# Altium project HU_revB.PrjPcb (part 3 of 4)

## Sheet 3V3_REG.SchDoc
size B; SheetNumber: 12; SheetTotal: 17
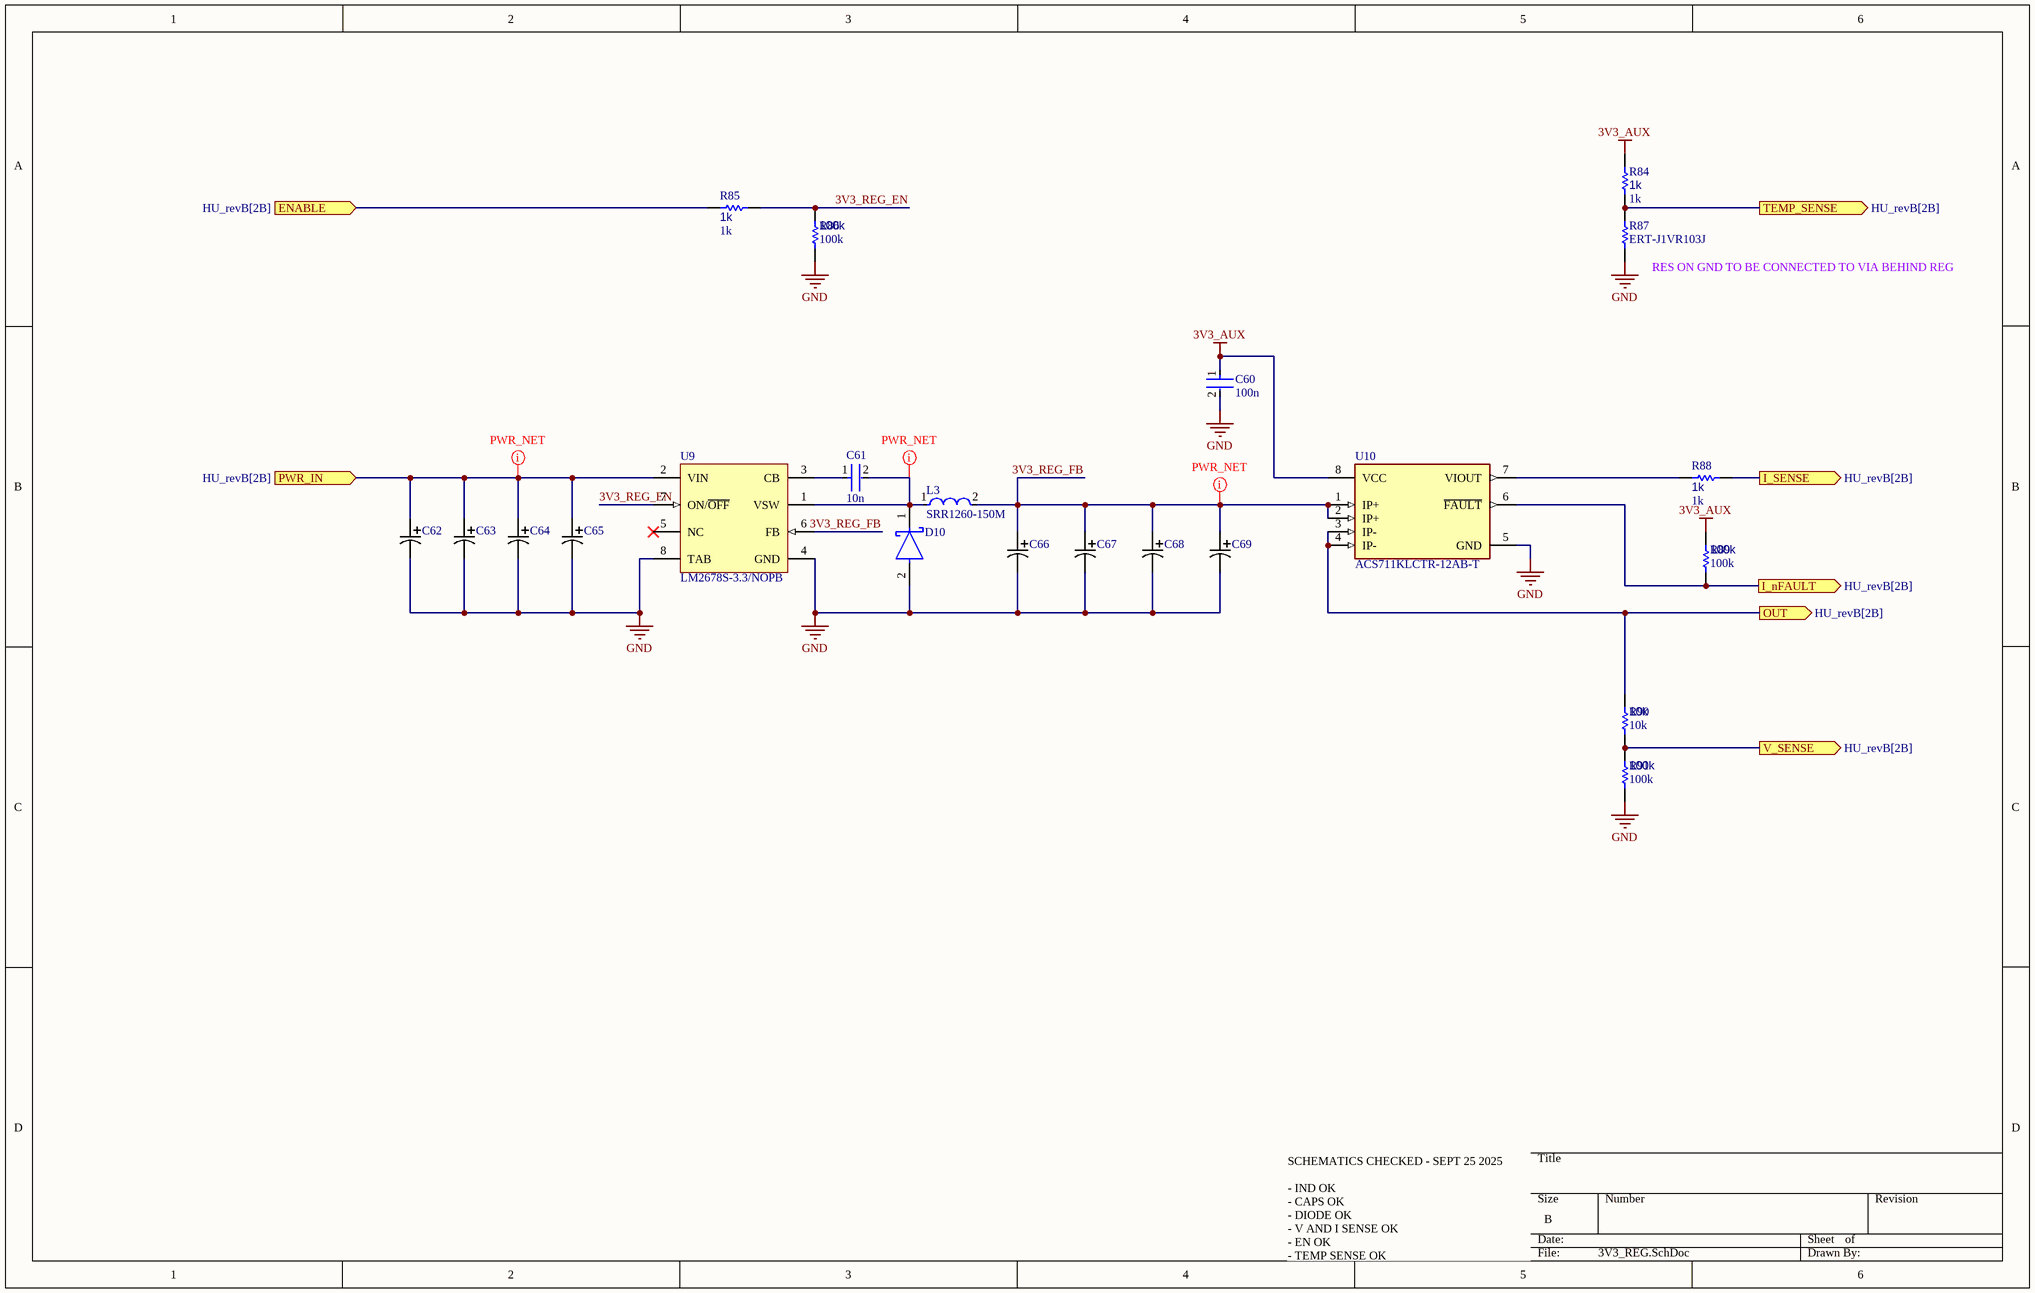
[diagram p17: 3V3_REG.SchDoc]

### Parts
C60  100n  [FP-0402-L_1_0_0_05-W_0_5-IPC_A]
C61  10n  [FP-0402-L_1_0_0_05-W_0_5-IPC_A]
C62  T495D475K050ATE300  [T495D475K050ATE300-Footprint-1]  (value not drawn)
C63  T495D475K050ATE300  [T495D475K050ATE300-Footprint-1]  (value not drawn)
C64  T495D475K050ATE300  [T495D475K050ATE300-Footprint-1]  (value not drawn)
C65  T495D475K050ATE300  [T495D475K050ATE300-Footprint-1]  (value not drawn)
C66  T495D337K010ATE150  [T495D337K010ATE150-Footprint-1]  (value not drawn)
C67  T495D337K010ATE150  [T495D337K010ATE150-Footprint-1]  (value not drawn)
C68  T495D337K010ATE150  [T495D337K010ATE150-Footprint-1]  (value not drawn)
C69  T495D337K010ATE150  [T495D337K010ATE150-Footprint-1]  (value not drawn)
D10  B540C-13-F  [FP-SMC-MFG]  (value not drawn)
L3  SRR1260-150M  [FP-SRR1260-MFG]
R84  1k  [R0603B]
R85  1k  [R0603B]
R86  100k  [R0603B]
R87  ERT-J1VR103J  [RESC1608X90X30ML15T20]
R88  1k  [R0603B]
R89  100k  [R0603B]
R90  10k  [R0603B]
R91  100k  [R0603B]
U9  LM2678S-3.3/NOPB  [KTW0007B_N]
U10  ACS711KLCTR-12AB-T  [FP-LC-8-IPC_C]

### Ports
ENABLE (in, see HU_revB[2B]), I_nFAULT (out, see HU_revB[2B]), I_SENSE (out, see HU_revB[2B]), OUT (out, see HU_revB[2B]), PWR_IN (in, see HU_revB[2B]), TEMP_SENSE (out, see HU_revB[2B]), V_SENSE (out, see HU_revB[2B])

### Nets
3V3_AUX: C60.1 R84.1 R89.2 R90.2 U10.3(IP-) U10.4(IP-) U10.8(VCC) ; port OUT
GND: C60.2 C62.2 C63.2 C64.2 C65.2 C66.2 C67.2 C68.2 C69.2 D10.2(A) R86.1 R87.1 R91.1 U9.4(GND) U9.8(TAB) U10.5(GND)
3V3_EN: R85.2 ; port ENABLE
3V3_REG_EN: R85.1 R86.2 U9.7(ON/~{OFF})
3V3_REG_FB: C66.1 C67.1 C68.1 C69.1 L3.2 U9.6(FB) U10.1(IP+) U10.2(IP+)
NetC61_1: C61.1 U9.3(CB)
NetC61_2: C61.2 D10.1(C) L3.1 U9.1(VSW)
NetC62_1: C62.1 C63.1 C64.1 C65.1 U9.2(VIN) ; port PWR_IN
NetR84_2: R84.2 R87.2 ; port TEMP_SENSE
NetR88_1: R88.1 ; port I_SENSE
NetR88_2: R88.2 U10.7(VIOUT)
NetR89_1: R89.1 U10.6(~{FAULT}) ; port I_nFAULT
NetR90_1: R90.1 R91.2 ; port V_SENSE

Not connected (* = marked no-connect by the designer): U9 5(NC)*

### Layout directives
net class PWR: 3V3_REG_FB, NetC61_2, NetC62_1

### Notes on the sheet
- (near R87) RES ON GND TO BE CONNECTED TO VIA BEHIND REG
- SCHEMATICS CHECKED - SEPT 25 2025
  - IND OK
  - CAPS OK
  - DIODE OK
  - V AND I SENSE OK
  - EN OK
  - TEMP SENSE OK

### Library data of the parts
C60 C61 = CMP-001-00058-1: as C19-C28 on sheet NVME; Min Operating Temperature: -55°C; Mounting Technology: Surface Mount; Pins: 2; Case/Package: 0402; RoHS Compliant: Yes; Max Operating Temperature: 85°C
C62-C65 = CMP-001-00066-1: Cap Tant Solid 4.7uF 50V D CASE 10% (7.3 X 4.3 X 2.8mm) SMD 7343-31 0.3 Ohm 125 C T/R; Value: 4.7µF; Min Operating Temperature: -55°C; Voltage Rating: 50V; Tolerance: 10%; Mounting Technology: Surface Mount; Max Operating Temperature: 125°C; Case/Package: 7343-31; Pins: 2
C66-C69 = CMP-001-00067-1: 330uF Solid MnO2 Tantalum Capacitor, 10 V dc +/-10%, T495 Series; Tolerance: 10%; Voltage Rating: 10V; Value: 330µF; Case/Package: 2917; Min Operating Temperature: -55°C; Mounting Technology: Surface Mount; Max Operating Temperature: 125°C
D10 = CMP-2000-05097-3: DIODE SCHOTTKY 40V 5A SMC; Manufacturer: Diodes Inc.; Automotive Grade: NA; Peak Reverse Current: 0.5mA; Value: 300pF; Max Junction Temp: +150°C; Max Surge Forward Current: 100A; Standoff Height: 0.1mm; Digikey Description: DIODE SCHOTTKY 40V 5A SMC; Temperature Range Low: -55°C; Manufacturer Part Number: B540C-13-F; Octopart: https://octopart.com/b540c-13-f-diodes+inc.-325873; Lead Free: Yes; Reverse Voltage: 40V; RoHS: TRUE; Category: Diode; Mouser Description: Diode: Schottky rectifying; SMD; 40V; 5A; SMC; Package: reel, tape; ComponentLink2Description: Datasheet; Temperature Range High: +150°C; Automotive: No; Footprint Url: https://www.diodes.com/assets/Package-Files/SMC.pdf; Device Class L3: Schottky Diodes; Height: 2.5mm; Forward Current: 5A; Temperature: -55°C to +150°C; Package: SMC; ComponentLink2URL: https://www.diodes.com/assets/Datasheets/ds13012.pdf; Device Class L2: Diodes; Max Repetitive Reverse Voltage: 40V; Device Class L1: Discrete Semiconductors; Capacitance: 300pF
L3 = CMP-2000-07146-2: FIXED IND 15UH 5A 27 MOHM SMD; Q Factor: 25; Sample Rate (Hz): 100kHz; Resistance: 27MR; Material: Steel; Inductance Tolerance: 20%; Frequency: 17.6MHz; Saturation Current: 4.6A; Core Material: Ferrite; Shielding: Shielded; Series: SRR1260; Termination: SMD/SMT; Packaging: Tape and Reel; RoHS Compliant: Yes; Height - Seated (Max): 0.256inch; Depth: 12.8mm; Case/Package: 1260; Inductance: 15uH; Height: 6mm; Number of Pins: 2; Mount: Surface Mount; Min Operating Temperature: -40°C; Test Frequency: 100kHz; Length: 12.5mm; Self Resonant Frequency: 17.6MHz; Current Rating: 5A; Tolerance: 20%; RMS Current (Irms): 5A; REACH SVHC: No SVHC; Resistor Type: Wirewound; DC Resistance (DCR): 27mR; Width: 12.5mm; Package Quantity: 600; DC Current: 5A; Max DC Current: 5A; Max Operating Temperature: 125°C; Military Standard: Not
R84-R86 R88-R91 = CMP-009-00002-14: Resistor
  R84 R85 R88: Value: 1k
  R86 R89 R91: Value: 100k
  R90: Value: 10k
R87 = CMP-2000-00869-1: Manufacturer: Panasonic; Part Number: ERT-J1VR103J
U9 = CMP-0069-00195-3: SIMPLE SWITCHER® High Efficiency 5A Step-Down Voltage Regulator, 7-pin TO-263, Pb-Free; Manufacturer: Texas Instruments; PackageTopMarking: NSUZXYTTE#*LM2678*S-3.3; PowerWise: N; PackageReference: KTW0007B; Code_JEDEC: MO-169-AC; CompType: Switcher; RoHS: Y; PackageDescription: TO-263, Molded, .400 x .390 x .180in Body, 7 Lead, .050in Pitch, Surface Mount; ComponentLink1Description: Datasheet URL; PinCount: 7; ComponentLink1URL: http://www.ti.com/general/docs/lit/getliterature.tsp?genericPartNumber=LM2678&fileType=pdf
U10 = CMP-1557-00012-2: SENSOR CURRENT HALL 12.5A AC/DC; Number of Channels: 1; Min Supply Voltage: 3V; Sensitivity: 110mV/A; Response Time: 4.6us; Operating Supply Voltage: 3.3V; Max Supply Voltage: 5.5V; Max Supply Current: 5.5mA; Bandwidth: 100kHz; Linearity: 1%; Quiescent Current: 4mA; Accuracy: 5%; Polarity: Bidirectional; Case/Package: SOIC; Packaging: Tape and Reel; Number of Pins: 8; Width: 3.9mm; Frequency: 100kHz; -3db Bandwidth: 100kHz; REACH SVHC: No SVHC; Series: -; Height: 1.5mm; Package Quantity: 1; Min Operating Temperature: -40°C; Max Operating Temperature: 125°C; Current Sensing: 12.5A; RoHS Compliant: Yes; Length: 4.9mm

## Sheet GMSL_DESERIALIZER.SchDoc
size C; SheetNumber: 13; SheetTotal: 17
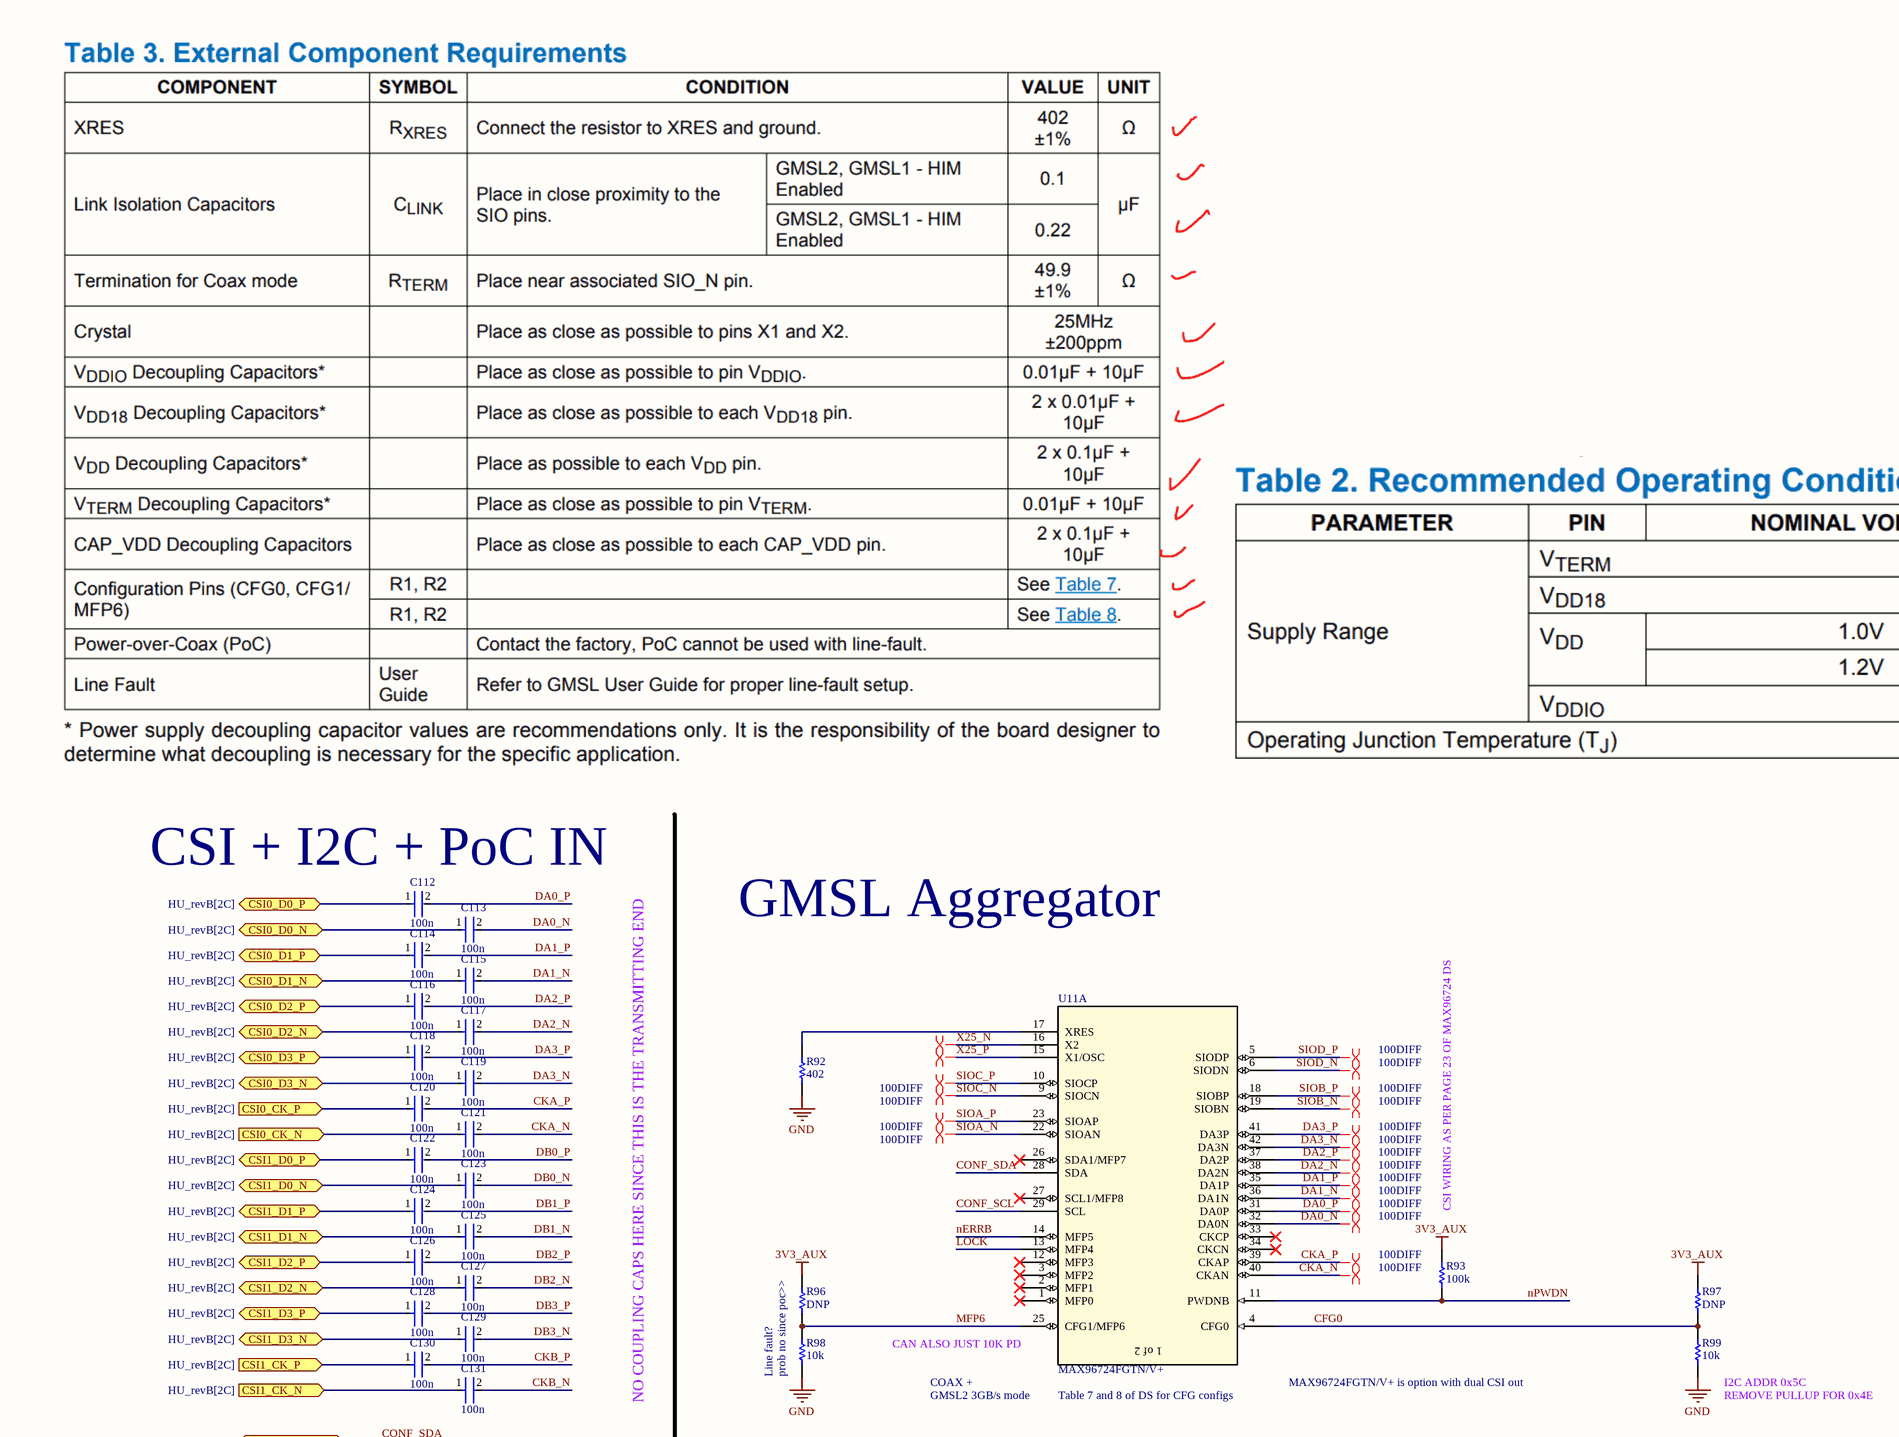
[diagram p18: GMSL_DESERIALIZER.SchDoc, top left]
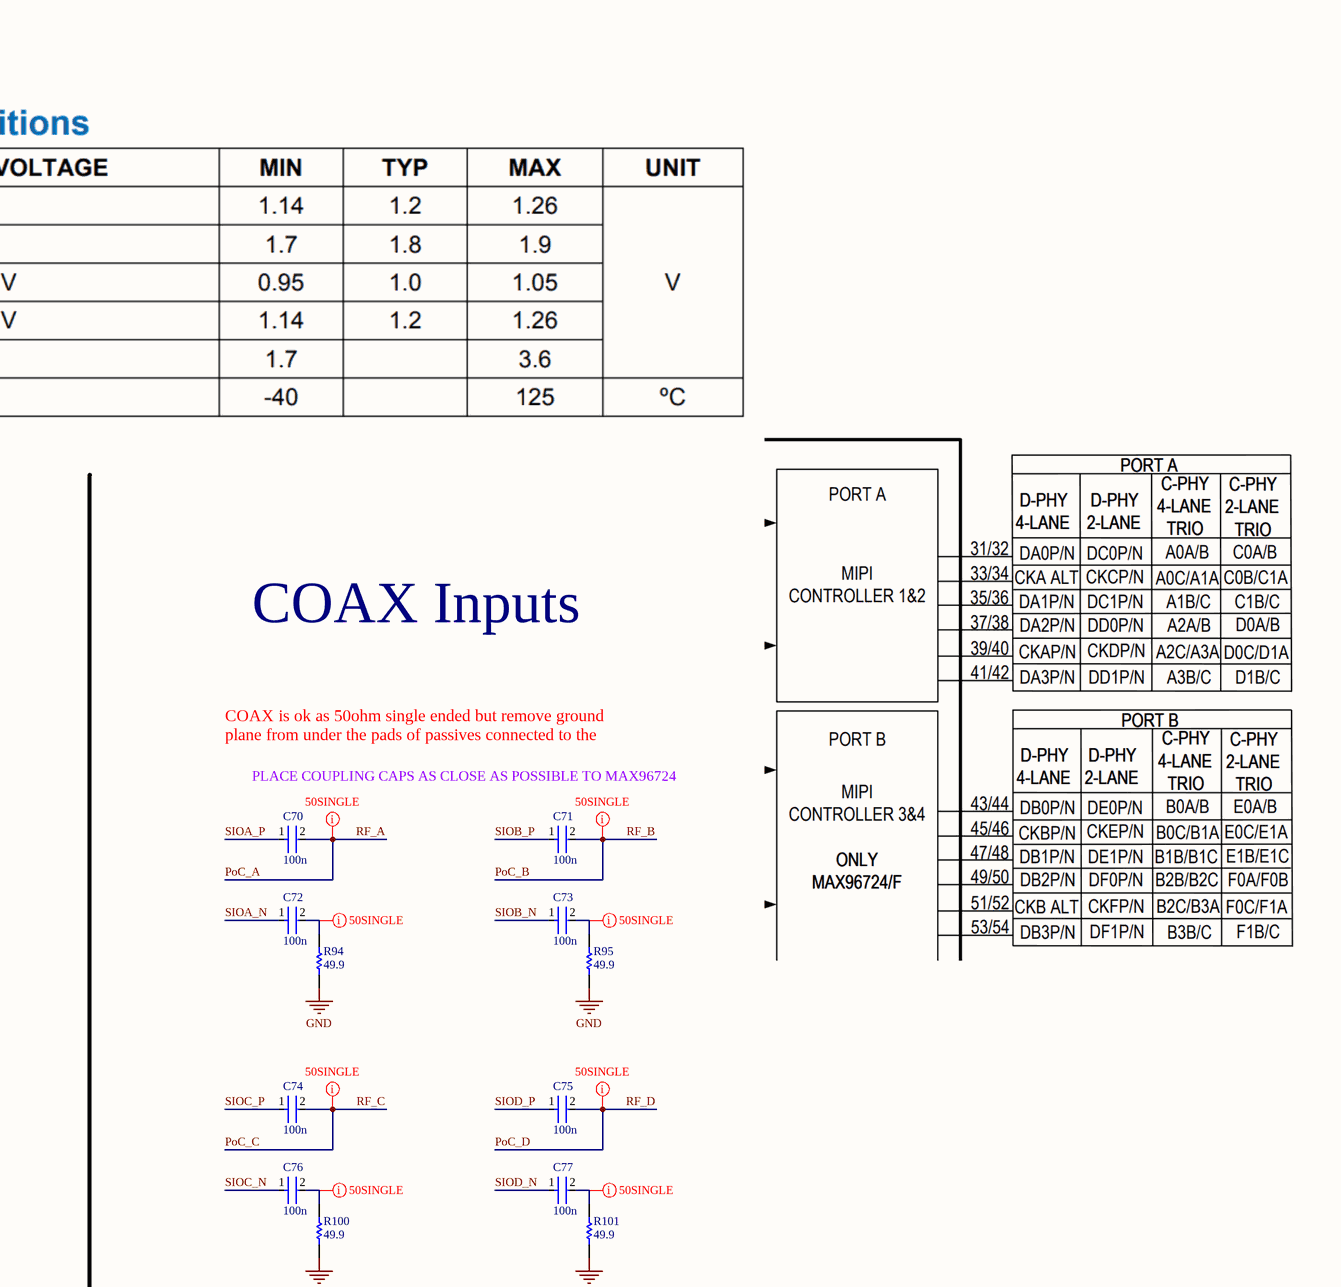
[diagram p19: GMSL_DESERIALIZER.SchDoc, top right]
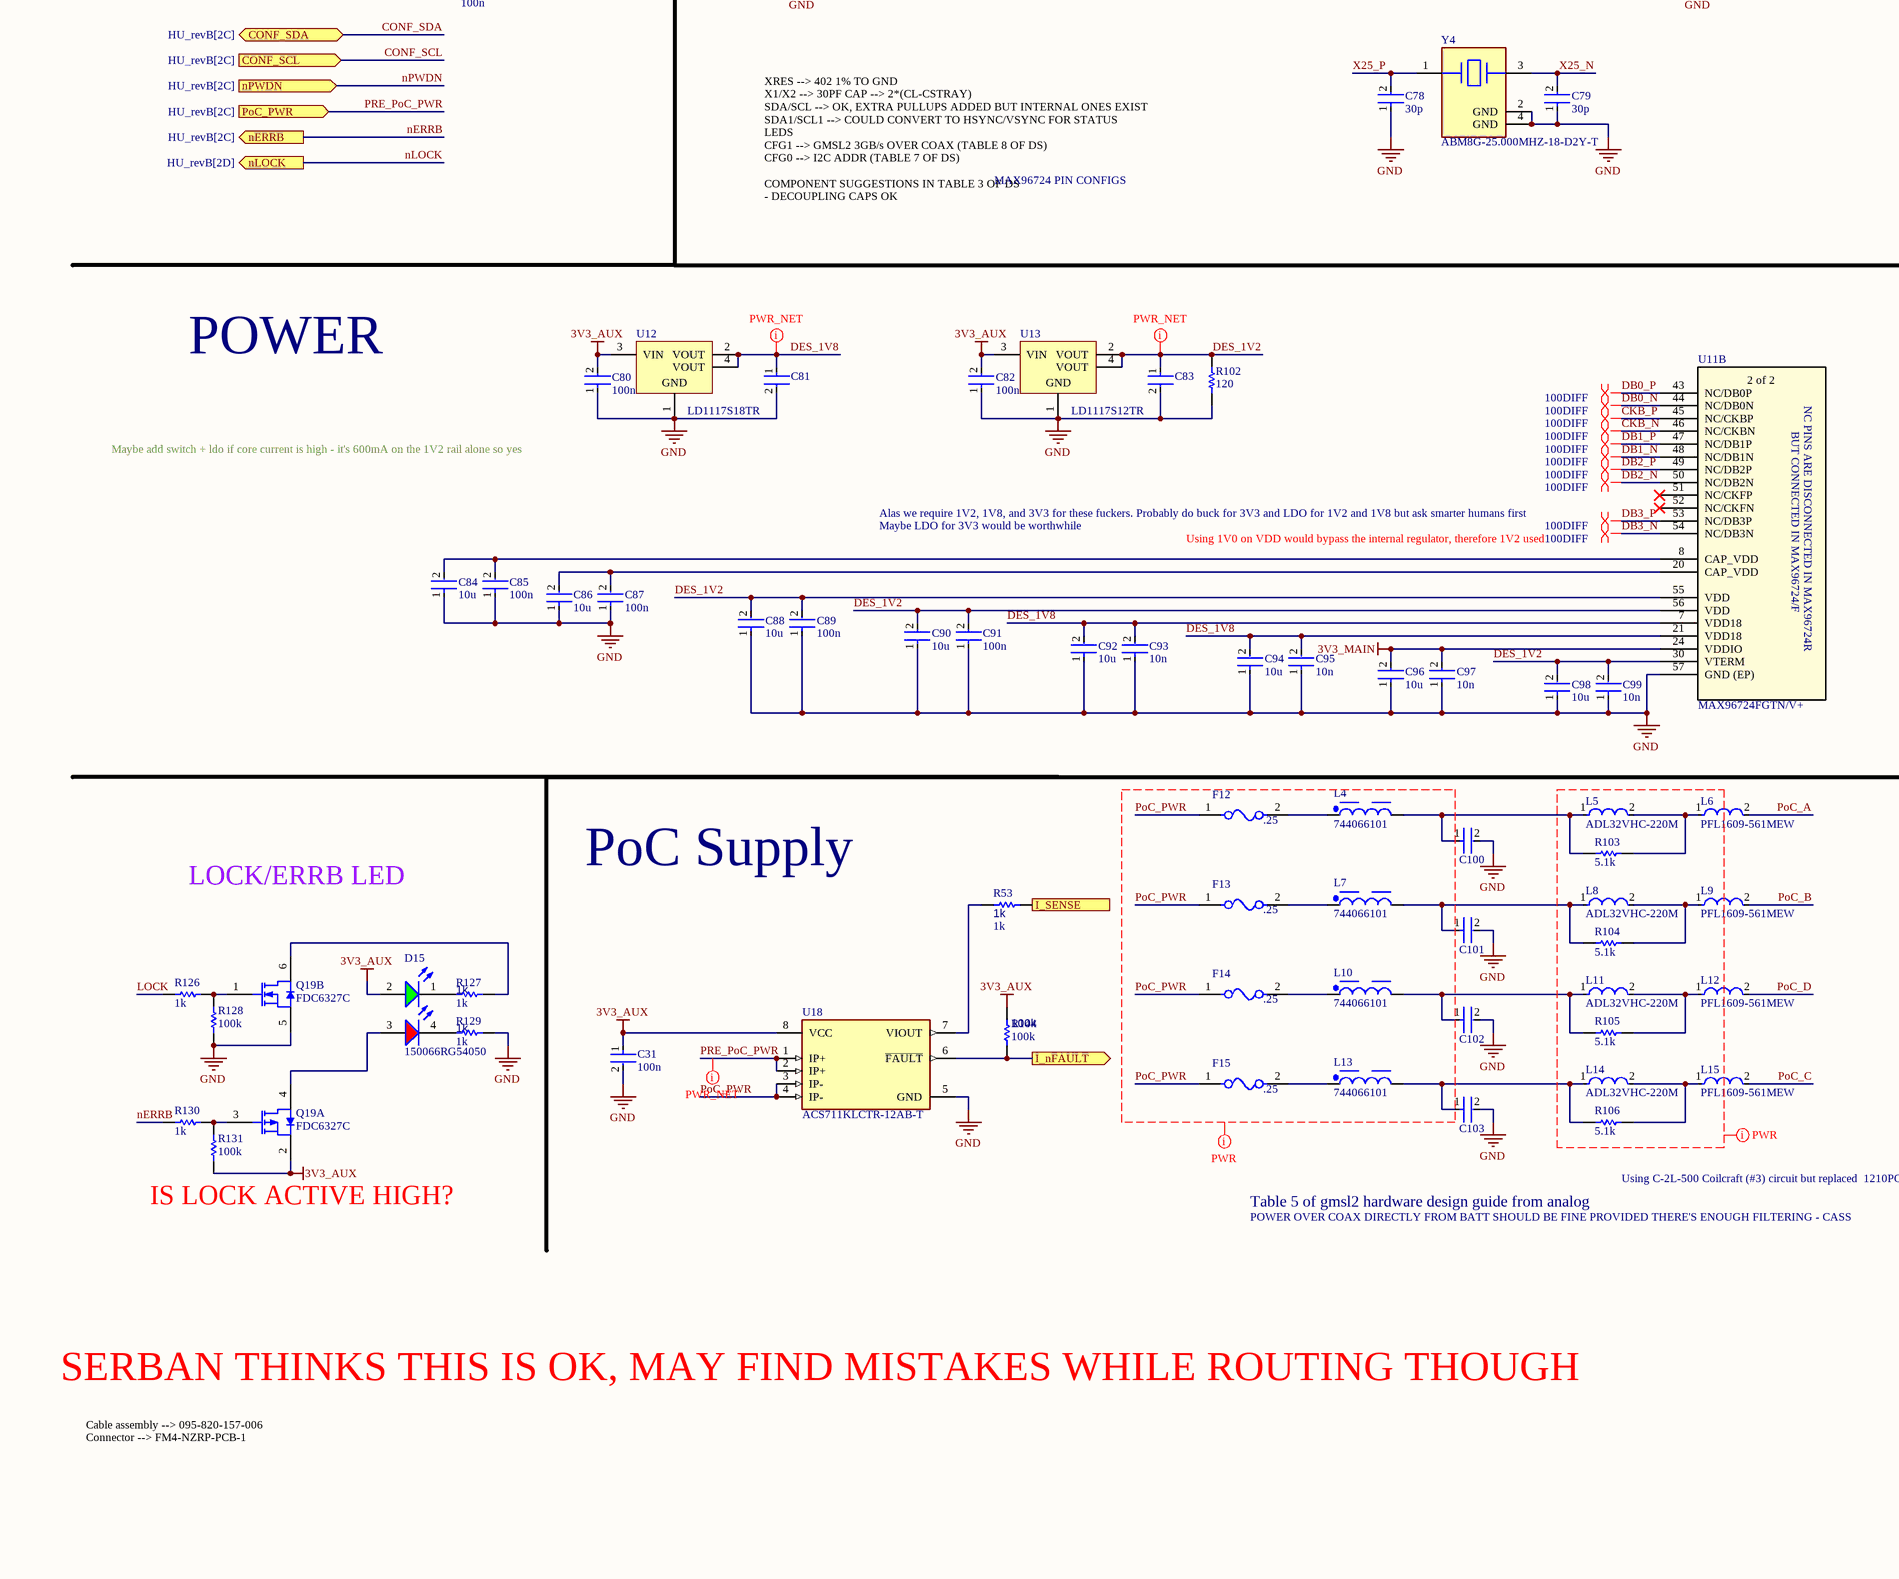
[diagram p20: GMSL_DESERIALIZER.SchDoc, bottom left]
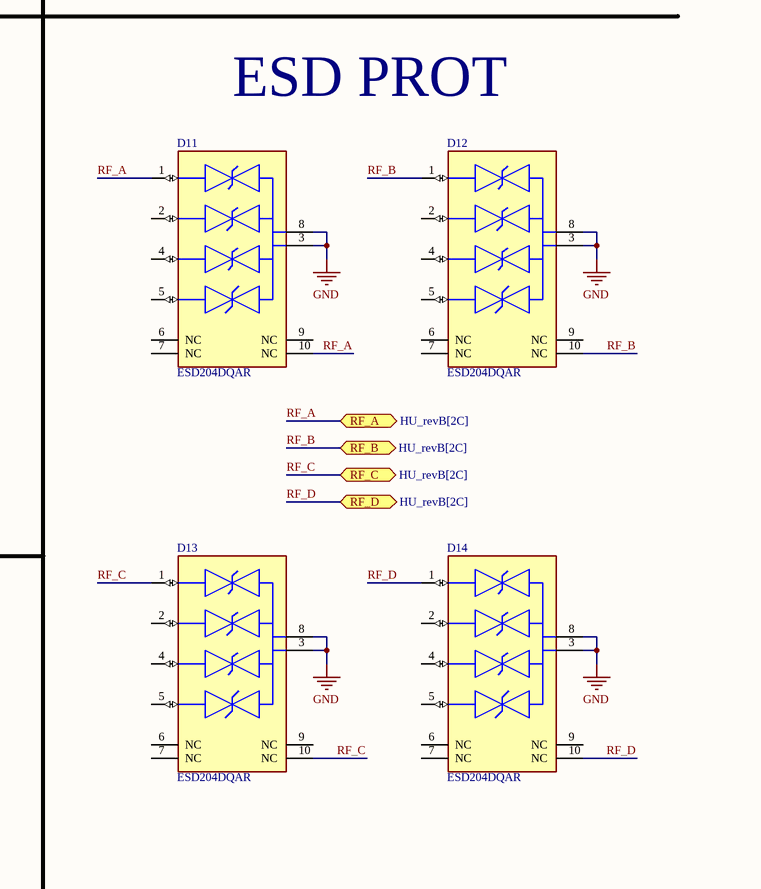
[diagram p21: GMSL_DESERIALIZER.SchDoc, bottom right]

### Parts
(Parts that share a designator on the sheet are numbered #1, #2 ... from top to bottom, then left to right.)
C31#2  100n  [FP-0402-L_1_0_0_05-W_0_5-IPC_A]
C70  100n  [FP-0402-L_1_0_0_05-W_0_5-IPC_A]
C71  100n  [FP-0402-L_1_0_0_05-W_0_5-IPC_A]
C72  100n  [FP-0402-L_1_0_0_05-W_0_5-IPC_A]
C73  100n  [FP-0402-L_1_0_0_05-W_0_5-IPC_A]
C74  100n  [FP-0402-L_1_0_0_05-W_0_5-IPC_A]
C75  100n  [FP-0402-L_1_0_0_05-W_0_5-IPC_A]
C76  100n  [FP-0402-L_1_0_0_05-W_0_5-IPC_A]
C77  100n  [FP-0402-L_1_0_0_05-W_0_5-IPC_A]
C78  30p  [FP-0402-L_1_0_0_05-W_0_5-IPC_A]
C79  30p  [FP-0402-L_1_0_0_05-W_0_5-IPC_A]
C80  100n  [FP-0402-L_1_0_0_05-W_0_5-IPC_A]
C81  GRM188R60J106ME47D  [FP-GRM188-0_1-e0_2_0_55-IPC_A]  (value not drawn)
C82  100n  [FP-0402-L_1_0_0_05-W_0_5-IPC_A]
C83  GRM188R60J106ME47D  [FP-GRM188-0_1-e0_2_0_55-IPC_A]  (value not drawn)
C84  10u  [FP-0402-L_1_0_0_05-W_0_5-IPC_A]
C85  100n  [FP-0402-L_1_0_0_05-W_0_5-IPC_A]
C86  10u  [FP-0402-L_1_0_0_05-W_0_5-IPC_A]
C87  100n  [FP-0402-L_1_0_0_05-W_0_5-IPC_A]
C88  10u  [FP-0402-L_1_0_0_05-W_0_5-IPC_A]
C89  100n  [FP-0402-L_1_0_0_05-W_0_5-IPC_A]
C90  10u  [FP-0402-L_1_0_0_05-W_0_5-IPC_A]
C91  100n  [FP-0402-L_1_0_0_05-W_0_5-IPC_A]
C92  10u  [FP-0402-L_1_0_0_05-W_0_5-IPC_A]
C93  10n  [FP-0402-L_1_0_0_05-W_0_5-IPC_A]
C94  10u  [FP-0402-L_1_0_0_05-W_0_5-IPC_A]
C95  10n  [FP-0402-L_1_0_0_05-W_0_5-IPC_A]
C96  10u  [FP-0402-L_1_0_0_05-W_0_5-IPC_A]
C97  10n  [FP-0402-L_1_0_0_05-W_0_5-IPC_A]
C98  10u  [FP-0402-L_1_0_0_05-W_0_5-IPC_A]
C99  10n  [FP-0402-L_1_0_0_05-W_0_5-IPC_A]
C100  GRM21BR61E226ME44L  [FP-GRM21B-0_2-e0_2_0_7-IPC_B]  (value not drawn)
C101  GRM21BR61E226ME44L  [FP-GRM21B-0_2-e0_2_0_7-IPC_B]  (value not drawn)
C102  GRM21BR61E226ME44L  [FP-GRM21B-0_2-e0_2_0_7-IPC_B]  (value not drawn)
C103  GRM21BR61E226ME44L  [FP-GRM21B-0_2-e0_2_0_7-IPC_B]  (value not drawn)
C112  100n  [FP-0402-L_1_0_0_05-W_0_5-IPC_A]
C113  100n  [FP-0402-L_1_0_0_05-W_0_5-IPC_A]
C114  100n  [FP-0402-L_1_0_0_05-W_0_5-IPC_A]
C115  100n  [FP-0402-L_1_0_0_05-W_0_5-IPC_A]
C116  100n  [FP-0402-L_1_0_0_05-W_0_5-IPC_A]
C117  100n  [FP-0402-L_1_0_0_05-W_0_5-IPC_A]
C118  100n  [FP-0402-L_1_0_0_05-W_0_5-IPC_A]
C119  100n  [FP-0402-L_1_0_0_05-W_0_5-IPC_A]
C120  100n  [FP-0402-L_1_0_0_05-W_0_5-IPC_A]
C121  100n  [FP-0402-L_1_0_0_05-W_0_5-IPC_A]
C122  100n  [FP-0402-L_1_0_0_05-W_0_5-IPC_A]
C123  100n  [FP-0402-L_1_0_0_05-W_0_5-IPC_A]
C124  100n  [FP-0402-L_1_0_0_05-W_0_5-IPC_A]
C125  100n  [FP-0402-L_1_0_0_05-W_0_5-IPC_A]
C126  100n  [FP-0402-L_1_0_0_05-W_0_5-IPC_A]
C127  100n  [FP-0402-L_1_0_0_05-W_0_5-IPC_A]
C128  100n  [FP-0402-L_1_0_0_05-W_0_5-IPC_A]
C129  100n  [FP-0402-L_1_0_0_05-W_0_5-IPC_A]
C130  100n  [FP-0402-L_1_0_0_05-W_0_5-IPC_A]
C131  100n  [FP-0402-L_1_0_0_05-W_0_5-IPC_A]
D11  ESD204DQAR  [FP-DQA0010A-MFG]
D12  ESD204DQAR  [FP-DQA0010A-MFG]
D13  ESD204DQAR  [FP-DQA0010A-MFG]
D14  ESD204DQAR  [FP-DQA0010A-MFG]
D15  150066RG54050  [WL-SBCD_0606]
F12  .25  [FP-0685T-MFG]
F13  .25  [FP-0685T-MFG]
F14  .25  [FP-0685T-MFG]
F15  .25  [FP-0685T-MFG]
L4  744066101  [WE-TPC_1038]
L5  ADL32VHC-220M  [FP-1210POC-MFG]
L6  PFL1609-561MEW  [FP-PFL1609-MFG]
L7  744066101  [WE-TPC_1038]
L8  ADL32VHC-220M  [FP-1210POC-MFG]
L9  PFL1609-561MEW  [FP-PFL1609-MFG]
L10  744066101  [WE-TPC_1038]
L11  ADL32VHC-220M  [FP-1210POC-MFG]
L12  PFL1609-561MEW  [FP-PFL1609-MFG]
L13  744066101  [WE-TPC_1038]
L14  ADL32VHC-220M  [FP-1210POC-MFG]
L15  PFL1609-561MEW  [FP-PFL1609-MFG]
Q19  FDC6327C  [FAIR-SOT23-6_V]  (parts A,B of 2)
R53#2  1k  [R0603B]
R92  402  [R0603B]
R93  100k  [R0603B]
R94  49.9  [R0603B]
R95  49.9  [R0603B]
R96  DNP  [R0603B]
R97  DNP  [R0603B]
R98  10k  [R0603B]
R99  10k  [R0603B]
R100  49.9  [R0603B]
R101  49.9  [R0603B]
R102  120  [R0603B]
R103  5.1k  [R0603B]
R104  5.1k  [R0603B]
R105  5.1k  [R0603B]
R106  5.1k  [R0603B]
R126  1k  [R0603B]
R127  1k  [R0603B]
R128  100k  [R0603B]
R129  1k  [R0603B]
R130  1k  [R0603B]
R131  100k  [R0603B]
R144  100k  [R0603B]
U11  MAX96724FGTN/V+  [MAX96724FGTN_V+-Footprint-1]  (parts A,B of 2)
U12  LD1117S18TR  [SOT-223_M]
U13  LD1117S12TR  [SOT-223_M]
U18  ACS711KLCTR-12AB-T  [FP-LC-8-IPC_C]
Y4  ABM8G-25.000MHZ-18-D2Y-T  [FP-ABM8G-MFG]

### Ports
CONF_SCL (in, see HU_revB[2C]), CONF_SDA (bidir, see HU_revB[2C]), CSI0_CK_N (in, see HU_revB[2C]), CSI0_CK_P (in, see HU_revB[2C]), CSI0_D0_N (bidir, see HU_revB[2C]), CSI0_D0_P (bidir, see HU_revB[2C]), CSI0_D1_N (bidir, see HU_revB[2C]), CSI0_D1_P (bidir, see HU_revB[2C]), CSI0_D2_N (bidir, see HU_revB[2C]), CSI0_D2_P (bidir, see HU_revB[2C]), CSI0_D3_N (bidir, see HU_revB[2C]), CSI0_D3_P (bidir, see HU_revB[2C]), CSI1_CK_N (in, see HU_revB[2C]), CSI1_CK_P (in, see HU_revB[2C]), CSI1_D0_N (bidir, see HU_revB[2C]), CSI1_D0_P (bidir, see HU_revB[2C]), CSI1_D1_N (bidir, see HU_revB[2C]), CSI1_D1_P (bidir, see HU_revB[2C]), CSI1_D2_N (bidir, see HU_revB[2C]), CSI1_D2_P (bidir, see HU_revB[2C]), CSI1_D3_N (bidir, see HU_revB[2C]), CSI1_D3_P (bidir, see HU_revB[2C]), I_nFAULT (out), I_SENSE (out), nERRB (out, see HU_revB[2C]), nLOCK (out, see HU_revB[2D]), nPWDN (in, see HU_revB[2C]), PoC_PWR (in, see HU_revB[2C]), RF_A (bidir, see HU_revB[2C]), RF_B (bidir, see HU_revB[2C]), RF_C (bidir, see HU_revB[2C]), RF_D (bidir, see HU_revB[2C])

### Nets
3V3_AUX: C31#2.1 C80.2 C82.2 D15.2(A) Q19.2(S) R93.2 R96.2 R97.2 R131.1 R144.2 U12.3(VIN) U13.3(VIN) U18.8(VCC)
3V3_MAIN: C96.2 C97.2 U11.24(VDDIO)
GND: C31#2.2 C78.1 C79.1 C80.1 C81.2 C82.1 C83.2 C84.1 C85.1 C86.1 C87.1 C88.1 C89.1 C90.1 C91.1 C92.1 C93.1 C94.1 C95.1 C96.1 C97.1 C98.1 C99.1 C100.2 C101.2 C102.2 C103.2 D11.3(GND) D11.8(GND) D12.3(GND) D12.8(GND) D13.3(GND) D13.8(GND) D14.3(GND) D14.8(GND) Q19.5(S) R92.1 R94.1 R95.1 R98.1 R99.1 R100.1 R101.1 R102.1 R128.2 R129.1 U11.57(GND_(EP)) U12.1(GND) U13.1(GND) U18.5(GND) Y4.2(GND) Y4.4(GND)
CFG0: R97.1 R99.2 U11.4(CFG0)
CKA_N: C121.2 U11.40(CKAN)
CKA_P: C120.2 U11.39(CKAP)
CKB_N: C131.2 U11.46(NC/CKBN)
CKB_P: C130.2 U11.45(NC/CKBP)
CONF_SCL: U11.29(SCL) ; port CONF_SCL
CONF_SDA: U11.28(SDA) ; port CONF_SDA
DA0_N: C113.2 U11.32(DA0N)
DA0_P: C112.2 U11.31(DA0P)
DA1_N: C115.2 U11.36(DA1N)
DA1_P: C114.2 U11.35(DA1P)
DA2_N: C117.2 U11.38(DA2N)
DA2_P: C116.2 U11.37(DA2P)
DA3_N: C119.2 U11.42(DA3N)
DA3_P: C118.2 U11.41(DA3P)
DB0_N: C123.2 U11.44(NC/DB0N)
DB0_P: C122.2 U11.43(NC/DB0P)
DB1_N: C125.2 U11.48(NC/DB1N)
DB1_P: C124.2 U11.47(NC/DB1P)
DB2_N: C127.2 U11.50(NC/DB2N)
DB2_P: C126.2 U11.49(NC/DB2P)
DB3_N: C129.2 U11.54(NC/DB3N)
DB3_P: C128.2 U11.53(NC/DB3P)
DES_1V2: C83.1 C88.2 C89.2 C90.2 C91.2 C98.2 C99.2 R102.2 U11.30(VTERM) U11.55(VDD) U11.56(VDD) U13.2(VOUT) U13.4(VOUT)
DES_1V8: C81.1 C92.2 C93.2 C94.2 C95.2 U11.7(VDD18) U11.21(VDD18) U12.2(VOUT) U12.4(VOUT)
DPHY0_CK_N: C121.1 ; port CSI0_CK_N
DPHY0_CK_P: C120.1 ; port CSI0_CK_P
DPHY0_D0_N: C113.1 ; port CSI0_D0_N
DPHY0_D0_P: C112.1 ; port CSI0_D0_P
DPHY0_D1_N: C115.1 ; port CSI0_D1_N
DPHY0_D1_P: C114.1 ; port CSI0_D1_P
DPHY0_D2_N: C117.1 ; port CSI0_D2_N
DPHY0_D2_P: C116.1 ; port CSI0_D2_P
DPHY0_D3_N: C119.1 ; port CSI0_D3_N
DPHY0_D3_P: C118.1 ; port CSI0_D3_P
DPHY1_CK_N: C131.1 ; port CSI1_CK_N
DPHY1_CK_P: C130.1 ; port CSI1_CK_P
DPHY1_D0_N: C123.1 ; port CSI1_D0_N
DPHY1_D0_P: C122.1 ; port CSI1_D0_P
DPHY1_D1_N: C125.1 ; port CSI1_D1_N
DPHY1_D1_P: C124.1 ; port CSI1_D1_P
DPHY1_D2_N: C127.1 ; port CSI1_D2_N
DPHY1_D2_P: C126.1 ; port CSI1_D2_P
DPHY1_D3_N: C129.1 ; port CSI1_D3_N
DPHY1_D3_P: C128.1 ; port CSI1_D3_P
LOCK: R126.2 U11.13(MFP4)
MFP6: R96.1 R98.2 U11.25(CFG1/MFP6)
nERRB: R130.1 U11.14(MFP5) ; port nERRB
nLOCK: port nLOCK
nPWDN: R93.1 U11.11(PWDNB) ; port nPWDN
PoC_A: C70.2 D11.1(IO1) D11.10(NC) L6.2 ; port RF_A  [also labelled RF_A]
PoC_B: C71.2 D12.1(IO1) D12.10(NC) L9.2 ; port RF_B  [also labelled RF_B]
PoC_C: C74.2 D13.1(IO1) D13.10(NC) L15.2 ; port RF_C  [also labelled RF_C]
PoC_D: C75.2 D14.1(IO1) D14.10(NC) L12.2 ; port RF_D  [also labelled RF_D]
PoC_PWR: F12.1 F13.1 F14.1 F15.1 U18.3(IP-) U18.4(IP-)
PRE_PoC_PWR: U18.1(IP+) U18.2(IP+) ; port PoC_PWR
SIOA_N: C72.1 U11.22(SIOAN)
SIOA_P: C70.1 U11.23(SIOAP)
SIOB_N: C73.1 U11.19(SIOBN)
SIOB_P: C71.1 U11.18(SIOBP)
SIOC_N: C76.1 U11.9(SIOCN)
SIOC_P: C74.1 U11.10(SIOCP)
SIOD_N: C77.1 U11.6(SIODN)
SIOD_P: C75.1 U11.5(SIODP)
X25_N: C79.2 U11.16(X2) Y4.3
X25_P: C78.2 U11.15(X1/OSC) Y4.1
NetC72_2: C72.2 R94.2
NetC73_2: C73.2 R95.2
NetC76_2: C76.2 R100.2
NetC77_2: C77.2 R101.2
NetC84_2: C84.2 C85.2 U11.8(CAP_VDD)
NetC86_2: C86.2 C87.2 U11.20(CAP_VDD)
NetC100_1: C100.1 L4.2 L5.1 R103.2
NetC101_1: C101.1 L7.2 L8.1 R104.2
NetC102_1: C102.1 L10.2 L11.1 R105.2
NetC103_1: C103.1 L13.2 L14.1 R106.2
NetD15_1: D15.1(K) R127.2
NetD15_3: D15.3(A) Q19.4(D)
NetD15_4: D15.4(K) R129.2
NetF12_2: F12.2 L4.1
NetF13_2: F13.2 L7.1
NetF14_2: F14.2 L10.1
NetF15_2: F15.2 L13.1
NetL5_2: L5.2 L6.1 R103.1
NetL8_2: L8.2 L9.1 R104.1
NetL11_2: L11.2 L12.1 R105.1
NetL14_2: L14.2 L15.1 R106.1
NetQ19_1: Q19.1(G) R126.1 R128.1
NetQ19_3: Q19.3(G) R130.2 R131.2
NetQ19_6: Q19.6(D) R127.1
NetR53#2_1: R53#2.1 ; port I_SENSE
NetR53#2_2: R53#2.2 U18.7(VIOUT)
NetR92_2: R92.2 U11.17(XRES)
NetR144_1: R144.1 U18.6(~{FAULT}) ; port I_nFAULT

Not connected (* = marked no-connect by the designer): D11 2(IO2) 4(IO3) 5(IO4) 6(NC) 7(NC) 9(NC); D12 2(IO2) 4(IO3) 5(IO4) 6(NC) 7(NC) 9(NC); D13 2(IO2) 4(IO3) 5(IO4) 6(NC) 7(NC) 9(NC); D14 2(IO2) 4(IO3) 5(IO4) 6(NC) 7(NC) 9(NC); U11 1(MFP0)* 2(MFP1)* 3(MFP2)* 12(MFP3)* 26(SDA1/MFP7)* 27(SCL1/MFP8)* 33(CKCP)* 34(CKCN)* 51(NC/CKFP)* 52(NC/CKFN)*

### Layout directives
differential pair: X25_N, X25_P
net class PWR: (no net found under the mark), DES_1V2, DES_1V8, PoC_PWR, PRE_PoC_PWR
net class 50SINGLE: NetC72_2, NetC73_2, NetC76_2, NetC77_2, PoC_A, PoC_B, PoC_C, PoC_D
differential pair; differential pair class 100DIFF: CKA_N, CKA_P, CKB_N, CKB_P, DA0_N, DA0_P, DA1_N, DA1_P, DA2_N, DA2_P, DA3_N, DA3_P, DB0_N, DB0_P, DB1_N, DB1_P, DB2_N, DB2_P, DB3_N, DB3_P, SIOA_N, SIOA_P, SIOB_N, SIOB_P, SIOC_N, SIOC_P, SIOD_N, SIOD_P

### Notes on the sheet
- (near C112) CSI + I2C + PoC IN
- GMSL Aggregator
- COAX Inputs
- COAX is ok as 50ohm single ended but remove ground plane from under the pads of passives connected to the GMSL trace
- PLACE COUPLING CAPS AS CLOSE AS POSSIBLE TO MAX96724
- CSI WIRING AS PER PAGE 23 OF MAX96724 DS
- Line fault?
- prob no since poc>>
- CAN ALSO JUST 10K PD
- NO COUPLING CAPS HERE SINCE THIS IS THE TRANSMITTING END
- GMSL2 3GB/s mode
- COAX +
- Table 7 and 8 of DS for CFG configs
- MAX96724FGTN/V+ is option with dual CSI out
- (near R99) I2C ADDR 0x5C
- (near R99) REMOVE PULLUP FOR 0x4E
- XRES --> 402 1% TO GND
  X1/X2 --> 30PF CAP --> 2*(CL-CSTRAY)
  SDA/SCL --> OK, EXTRA PULLUPS ADDED BUT INTERNAL ONES EXIST
  SDA1/SCL1 --> COULD CONVERT TO HSYNC/VSYNC FOR STATUS LEDS
  CFG1 --> GMSL2 3GB/s OVER COAX (TABLE 8 OF DS)
  CFG0 --> I2C ADDR (TABLE 7 OF DS)
  COMPONENT SUGGESTIONS IN TABLE 3 OF DS
  - DECOUPLING CAPS OK
- MAX96724 PIN CONFIGS
- ESD PROT
- POWER
- Maybe add switch + ldo if core current is high - it's 600mA on the 1V2 rail alone so yes
- Alas we require 1V2, 1V8, and 3V3 for these fuckers. Probably do buck for 3V3 and LDO for 1V2 and 1V8 but ask smarter humans first
- Maybe LDO for 3V3 would be worthwhile
- Using 1V0 on VDD would bypass the internal regulator, therefore 1V2 used
- LOCK/ERRB LED
- PoC Supply
- Using C-2L-500 Coilcraft (#3) circuit but replaced  1210POC-223
- (near R131) IS LOCK ACTIVE HIGH?
- Table 5 of gmsl2 hardware design guide from analog
- POWER OVER COAX DIRECTLY FROM BATT SHOULD BE FINE PROVIDED THERE'S ENOUGH FILTERING - CASS
- SERBAN THINKS THIS IS OK, MAY FIND MISTAKES WHILE ROUTING THOUGH
- Cable assembly --> 095-820-157-006
  Connector --> FM4-NZRP-PCB-1
- (in symbol CMP-015-00011-2, part A) 1 of 2
- (in symbol CMP-015-00011-2, part B) 2 of 2; NC PINS ARE DISCONNECTED IN MAX96724R; BUT CONNECTED IN MAX96724/F

### Library data of the parts
C31#2 C70-C80 C82 C84-C99 C112-C131 = CMP-001-00058-1: as C19-C28 on sheet NVME; Min Operating Temperature: -55°C; Mounting Technology: Surface Mount; Pins: 2; Case/Package: 0402; RoHS Compliant: Yes; Max Operating Temperature: 85°C
C81 C83 = CMP-2006-02792-2: Chip Multilayer Ceramic Capacitors for General Purpose, 0603, 10uF, X5R, 15%, 20%, 6.3V; Packaging: Tape and Reel; Voltage Rating (DC): 6.3V; Width: 0.031inch; Termination: SMD/SMT; Dielectric: X5R; Package Quantity: 4000; Voltage Rating: 6.3V; Capacitance: 10uF; Case/Package: 0603; Min Operating Temperature: -55°C; Voltage: 6.3V; Length: 1.6mm; Thickness: 0.035inch; Lead Free: Lead Free; Depth: 0.8mm; Case Code (Imperial): 0603; Max Operating Temperature: 85°C; Material: Ceramic; Height: 0.8mm; Tolerance: 20%; Mount: Surface Mount; REACH SVHC: No SVHC; Radiation Hardening: No; Case Code (Metric): 1608
C100-C103 = CMP-2007-03222-3: Chip Multilayer Ceramic Capacitors for General Purpose, 0805, 22uF, X5R, 15%, 20%, 25V; Case/Package: 0805; Depth: 1.25mm; Resistor Type: Ceramic; Voltage Rating: 25V; Lead Free: Lead Free; Voltage Rating (DC): 25V; Case Code (Metric): 2012; Thickness: 0.057inch; REACH SVHC: No SVHC; Material: Ceramic; Tolerance: 20%; Length: 2mm; Capacitance: 22uF; Case Code (Imperial): 0805; Max Operating Temperature: 85°C; Termination: SMD/SMT; Weight: 0.000335oz; Dielectric: X5R; Packaging: Tape and Reel; Voltage: 25V; Package Quantity: 3000; Height: 1.25mm; Mount: Surface Mount; Width: 1.25mm; Min Operating Temperature: -55°C
D11-D14 = CMP-04989-000002-1: 4-CHANNEL LOW-CAPACITANCE SURGE; Manufacturer: Texas Instruments; Value: 0.55pF; Reverse Standoff Voltage: 3.6V; Standoff Height: 0mm; Breakdown Voltage: 5.5V; Peak Pulse Current: 5.5A; Clamping Voltage: 11.5V; Direction: Bidirectional; Peak Pulse Power: 50W; Number Of Channels: 4; Ambient Temperature Range High: +125°C; ComponentLink2Description: Datasheet; Height: 0.55mm; Lead Free: Yes; Device Class L3: unset; Temperature Range High: +125°C; Temperature Range Low: -40°C; Package: DQA0010A; Temperature: -40°C to +125°C; Capacitance: 0.55pF; RoHS: TRUE; Mouser Description: 4-Channel Low-Capacitance Surge and ESD Protection Diode 10-USON -40 to 125; Category: Diode; Device Class L1: Circuit Protection; Octopart: https://octopart.com/esd204dqar-texas+instruments-89917476; Device Class L2: TVS Diodes; Ambient Temperature Range Low: -40°C; Manufacturer Part Number: ESD204DQAR; ComponentLink2URL: http://www.ti.com/lit/ds/symlink/esd204.pdf; Automotive: No; Digikey Description: 4-CHANNEL LOW-CAPACITANCE SURGE
D15 = CMP-004-00040-2: Led, Red/Grn, 180Mcd/230Mcd, 624Nm/525Nm Rohs Compliant: Yes; Source: rgled.SchLib; Component Type: Standard; Design Item ID: CMP-004-00034-2; Pins: 4
F12-F15 = CMP-16042-000006-1: FUSE BOARD MNT 5A 63VAC/VDC 1206; RoHS Compliant: Yes
L4 L7 L10 L13 = CMP-0227-00094-3: NexarPartId: 8917123; Current Rating: 1.2A; Shielding: Shielded; Core Material: Ferrite; Inductance: 100µH; Test Frequency: 100kHz; Tolerance: 30%; Resistance: 255mΩ; Self Resonant Frequency: 6MHz; Composition: Wirewound; Packaging: Cut Tape (CT); REACH SVHC: Unknown; Number of Pins: 2; Max DC Current: 1.2A; Saturation Current: 1.2A; Ambient Temperature Range High: 95°C; Weight: 1.273007g; Height: 3.8mm; Width: 10mm; Min Operating Temperature: -40°C; Max Operating Temperature: 125°C; Termination: SMD/SMT; Height - Seated (Max): 4.0894mm; Length: 10mm; RMS Current (Irms): 1.2A; Ambient Temperature Range Low: -40°C; RoHS: Compliant; Mount: Surface Mount; Depth: 10mm; DC Resistance (DCR): 255mΩ; Inductance Tolerance: 30%; Case/Package: Nonstandard
L5 L8 L11 L14 = CMP-11268-000041-1: NOT COILCRAFT - ACTUAL P# --> ADL32VHC-220M / - Power Injection Chokes for PoC; Manufacturer Part Number: 1210POC-223MRC; Value: 22uH; Core Material: Ferrite; Saturation Current: 720mA; Series Resistance: 0.88Ω; Rms Current: 700mA; Automotive Grade: Grade 1; Self Resonant Frequency: 70MHz; Test Frequency: 100kHz; Tolerance: 20%; Ambient Temperature Range High: +125°C; Manufacturer: coilcraft; Octopart: https://octopart.com/1210poc-223mrc-coilcraft-103207315; Category: Ind; Device Class L2: Inductors; RoHS: TRUE; Device Class L3: Fixed Inductors; Package: 1210POC; Ambient Temperature Range Low: -40°C; ComponentLink2URL: https://drive.google.com/open?id=15FlOq8Y4YbRFohfA_cJ40jgnqs8va2Mh; Lead Free: Yes; Inductance: 22uH; Device Class L1: Passive Components; ComponentLink2Description: Datasheet; Automotive: Yes; Height: 3mm
L6 L9 L12 L15 = CMP-11268-000007-1: Fixed Inductors PFL1609 Low Profile 0.56 uH 20 % 1.4 A; Manufacturer: coilcraft; Rms Current: 1100mA; Self Resonant Frequency: 600MHz; Core Material: Composite; Tolerance: 20%; Value: 0.56uH; Automotive Grade: Grade 1; Saturation Current: 710mA; Test Frequency: 7.9MHz; Shielding: true; Series Resistance: 130mΩ; Lead Free: Yes; Device Class L1: Passive Components; Package: PFL1609; Octopart: https://octopart.com/pfl1609-561mew-coilcraft-20329171; ComponentLink2URL: https://www.coilcraft.com/pdfs/pfl1609.pdf; Manufacturer Part Number: PFL1609-561MEW; Ambient Temperature Range Low: -40°C; Composition: Wirewound; Inductance: 0.56uH; Device Class L2: Inductors; Category: Ind; Device Class L3: Fixed Inductors; Mouser Description: Fixed Inductors PFL1609 Low Profile 0.56 uH 20 % 1.4 A; Automotive: Yes; ComponentLink2Description: Datasheet; Ambient Temperature Range High: +105°C; Height: 0.95mm; RoHS: TRUE
Q19 = CMP-2000-04939-1: Dual N & P-Channel 2.5 V Specified PowerTrench(TM) MOSFET, -55 to 150 degC, 6-Pin SOT-23, RoHS, Tape and Reel; Manufacturer: Fairchild; Typical Rise Time: 9@NChannel; Rad Hard: No; Maximum Drain Source Voltage: 20V; Typical Fall Time: 3@NChannel; Typical Turn-On Delay Time: 5@NChannel; Maximum Continuous Drain Current: 2.7@NChannel; Typical Turn-Off Delay Time: 12@NChannel; RDS-on: 80@4.5V@NChannel; Channel Mode: Enhancement; Maximum Gate Source Voltage: ±8V; Package Version: Rev. 5, 05/2015; Operating Temperature: -55to150degC; Packaging: Tape&Reel; Package Reference: SOT23-6; Package URL: https://www.fairchildsemi.com/package-drawings/MA/MA06A.pdf; Package Description: 6-Pin Small Outline Transistor, Body 2.9 x 1.6 mm, Pitch 0.95 mm; Manufacturer URL: https://www.fairchildsemi.com/; Channel Type: N; Datasheet Version: Rev. E, 07/2000; Package: 6SuperSOT; Datasheet URL: https://www.fairchildsemi.com/datasheets/FD/FDC6327C.pdf; Mounting: SurfaceMount; Category: MOSFET
R53#2 R92-R106 R126-R131 R144 = CMP-009-00002-14: Resistor
  R53#2 R127 R129: Value: 1k
  R144: Value: 100k
U11 = CMP-015-00011-2: Quad Tunneling GMSL2/1 to CSI-2 Deserializer
U12 = CMP-0244-00308-1: Fixed Low Drop Positive Voltage Regulator, 1.8V, 4-Pin SOT-223, Tape and Reel; ComponentLink1URL: http://www.st.com; PackageReference: SOT-223; PackageDescription: 4-Pin SOT-223 Package, 6.5 x 3.5 mm Body, 2.3 mm Pitch, 7 mm Lead Span; ComponentLink2URL: http://www.st.com/internet/com/TECHNICAL_RESOURCES/TECHNICAL_LITERATURE/DATASHEET/CD00000544.pdf; ComponentLink2Description: Datasheet; ComponentLink1Description: Manufacturer URL; DatasheetVersion: 1/11/2011; PackageVersion: 2010
U13 = CMP-0244-00318-1: Fixed Low Drop Positive Voltage Regulator, 1.2V, 4-Pin SOT-223, Tape and Reel; PackageDescription: 4-Pin SOT-223 Package, 6.5 x 3.5 mm Body, 2.3 mm Pitch, 7 mm Lead Span; PackageVersion: 2010; ComponentLink2Description: Datasheet; PackageReference: SOT-223; ComponentLink2URL: http://www.st.com/internet/com/TECHNICAL_RESOURCES/TECHNICAL_LITERATURE/DATASHEET/CD00000544.pdf; ComponentLink1Description: Manufacturer URL; DatasheetVersion: 1/11/2011; ComponentLink1URL: http://www.st.com
U18 = CMP-1557-00012-2: as U10 on sheet 3V3_REG; Case/Package: SOIC; Packaging: Tape and Reel; Number of Pins: 8; Width: 3.9mm; Frequency: 100kHz; -3db Bandwidth: 100kHz; REACH SVHC: No SVHC; Series: -; Height: 1.5mm; Package Quantity: 1; Min Operating Temperature: -40°C; Max Operating Temperature: 125°C; Current Sensing: 12.5A; RoHS Compliant: Yes; Length: 4.9mm
Y4 = CMP-2000-05733-3: Crystal 25MHz ±20ppm (Tol) ±30ppm (Stability) 18pF FUND 60Ω 4-Pin SMD T/R; Series Resistance: 60R; Length: 3.2mm; Depth: 2.5mm; Packaging: Tape and Reel; Min Operating Temperature: -40°C; Operating Frequency: 25 MHz; Lead Free: Lead Free; Number of Pins: 4; Frequency Tolerance: 20ppm; Radiation Hardening: No; Max Operating Temperature: 85°C; Termination: SMD/SMT; Frequency Stability: 30ppm; Frequency: 25MHz; Series: ABM8G; Mount: Surface Mount; Package Quantity: 1000; Height: 0.039inch; Width: 0.098inch; Case/Package: CSMD; ESR (Equivalent Series Resistance): 60R; Load Capacitance: 18pF; Tolerance: 20ppm

## Sheet PWR_SW.SchDoc
size A4; SheetNumber: 14; SheetTotal: 17
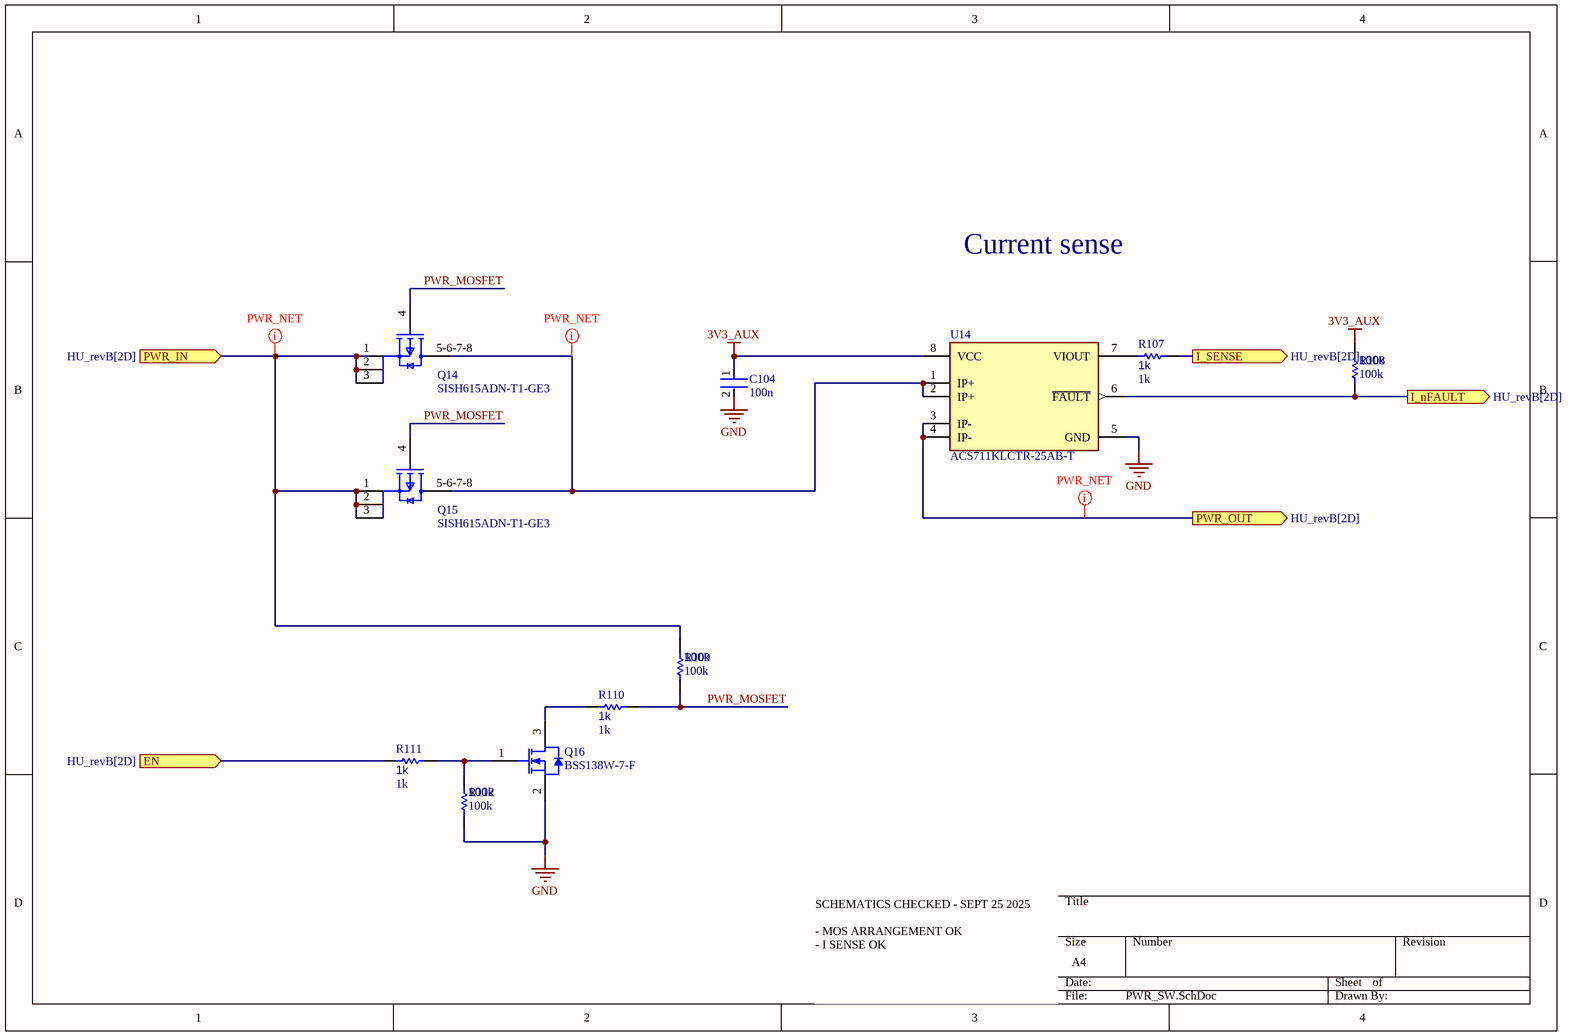
[diagram p22: PWR_SW.SchDoc]

### Parts
C104  100n  [FP-0402-L_1_0_0_05-W_0_5-IPC_A]
Q14  SISH615ADN-T1-GE3  [SISH615ADN-T1-GE3-Footprint-1]
Q15  SISH615ADN-T1-GE3  [SISH615ADN-T1-GE3-Footprint-1]
Q16  BSS138W-7-F  [DIOD-SOT323-3_V]
R107  1k  [R0603B]
R108  100k  [R0603B]
R109  100k  [R0603B]
R110  1k  [R0603B]
R111  1k  [R0603B]
R112  100k  [R0603B]
U14  ACS711KLCTR-25AB-T  [FP-LC-8-IPC_A]

### Ports
EN (in, see HU_revB[2D]), I_nFAULT (out, see HU_revB[2D]), I_SENSE (out, see HU_revB[2D]), PWR_IN (in, see HU_revB[2D]), PWR_OUT (out, see HU_revB[2D])

### Nets
3V3_AUX: C104.1 R108.2 U14.8(VCC)
AMP_VCC: U14.3(IP-) U14.4(IP-) ; port PWR_OUT
GND: C104.2 Q16.2(S) R112.1 U14.5(GND)
AMP_I_SENSE: R107.1 ; port I_SENSE
PWR_MOSFET: Q14.4(G) Q15.4(G) R109.1 R110.2
NetF7_2: Q14.1(S) Q14.2(S) Q14.3(S) Q15.1(S) Q15.2(S) Q15.3(S) R109.2 ; port PWR_IN
NetQ14_5-6-7-8: Q14.5-6-7-8(D) Q15.5-6-7-8(D) U14.1(IP+) U14.2(IP+)
NetQ16_1: Q16.1(G) R111.2 R112.2
NetQ16_3: Q16.3(D) R110.1
NetR107_2: R107.2 U14.7(VIOUT)
NetR108_1: R108.1 U14.6(~{FAULT}) ; port I_nFAULT
NetR111_1: R111.1 ; port EN

### Layout directives
net class PWR: AMP_VCC, NetF7_2, NetQ14_5-6-7-8

### Notes on the sheet
- Current sense
- SCHEMATICS CHECKED - SEPT 25 2025
  - MOS ARRANGEMENT OK
  - I SENSE OK

### Library data of the parts
C104 = CMP-001-00058-1: as C19-C28 on sheet NVME; Min Operating Temperature: -55°C; Mounting Technology: Surface Mount; Pins: 2; Case/Package: 0402; RoHS Compliant: Yes; Max Operating Temperature: 85°C
Q14 Q15 = CMP-013-00018-2: Trans MOSFET P-CH 20V 22.1A 8-Pin PowerPAK 1212 EP T/R; Source: SISH615ADN-T1-GE3.SchLib; Design Item ID: CMP-013-00036-4; Component Type: Standard; Pins: 5
Q16 = CMP-2000-05968-1: N-Channel Enhancement Mode Mosfet, 50 V, 200 mA, -55 to 150 degC, 6-Pin SOT-323, RoHS, Tape and Reel; Typical Turn-Off Delay Time: 20ns; Number of Channels: 1Channel; Type: EnhancementModeFieldEffectTransistor; Brand: DiodesIncorporated; Vds - Drain-Source Breakdown Voltage: 75V; Vgs - Gate-Source Voltage: 20V; Rds On - Drain-Source Resistance: 1.4Ohms; Transistor Type: 1N-Channel; Configuration: Single; Unit Weight: 0.000212oz; Pd - Power Dissipation: 200mW; Id - Continuous Drain Current: 200mA; Forward Transconductance - Min: 0.1S; Manufacturer URL: http://www.diodes.com/; Series: BSS138; Package Description: 3-Pin Small Outline Transistor, Body 2 x 1.25 mm, Pitch 0.65 mm; Mounting Technology: SurfaceMount; Product Category: MOSFET; RoHS: True; Maximum Operating Temperature: +150C; Height: 1mm; Length: 2.2mm; Technology: Si; Width: 1.35mm; Datasheet URL: http://www.diodes.com/_files/datasheets/ds30206.pdf; Manufacturer: DiodesIncorporated; Package / Case: SOT-323-3; Typical Turn-On Delay Time: 20ns; Transistor Polarity: N-Channel; Factory Pack Quantity: 3000; Packaging: Reel; Product: MOSFETSmallSignal; Datasheet Version: Rev. 11-2, 09/2013; Package Reference: SOT323; Minimum Operating Temperature: -55C; Mounting Style: SMD/SMT; Channel Mode: Enhancement
R107-R112 = CMP-009-00002-14: Resistor
  R107 R110 R111: Value: 1k
  R108 R109 R112: Value: 100k
U14 = CMP-1557-00015-2: SENSOR CURRENT HALL 25A AC/DC; Bandwidth: 100kHz; Min Supply Voltage: 3V; Polarity: Bidirectional; Max Supply Voltage: 5.5V; Max Supply Current: 5.5mA; Number of Channels: 1; Quiescent Current: 4mA; Sensitivity: 55mV/A; Accuracy: 4%; Linearity: 1%; Operating Supply Voltage: 3.3V; Response Time: 4.6us; Case/Package: SOIC; Min Operating Temperature: -40°C; RoHS Compliant: Yes; Length: 4.9mm; Package Quantity: 1; Number of Pins: 8; Width: 3.9mm; REACH SVHC: No SVHC; -3db Bandwidth: 100kHz; Series: -; Packaging: Tape and Reel; Max Operating Temperature: 125°C; Current Sensing: 25A; Height: 1.5mm; Frequency: 100kHz

## Sheet MAX_M10M_PINOUT.SchDoc
size B; SheetNumber: 15; SheetTotal: 17
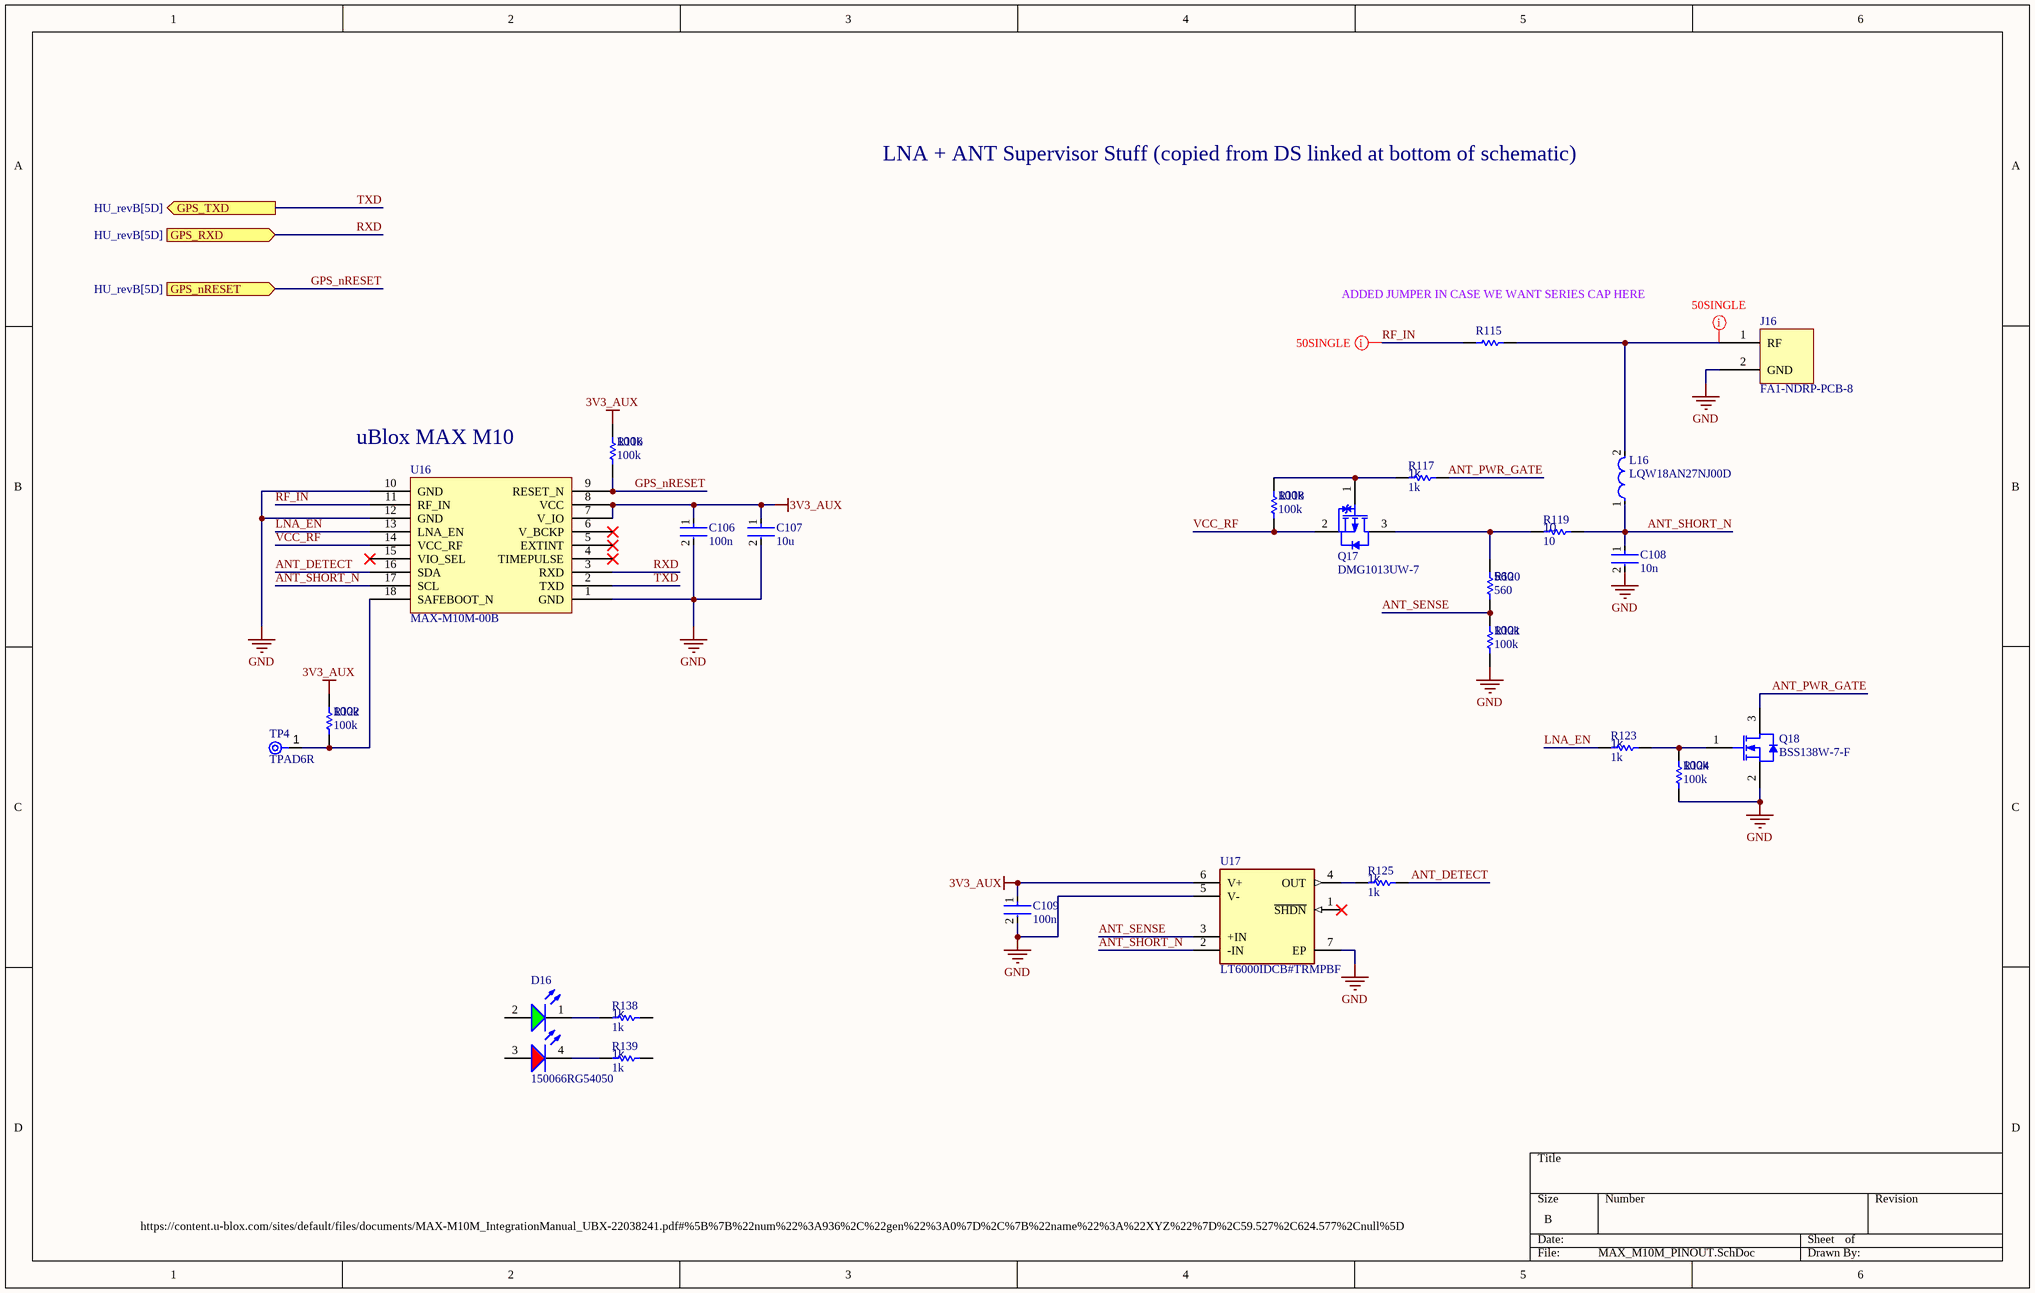
[diagram p23: MAX_M10M_PINOUT.SchDoc]

### Parts
C106  100n  [FP-0402-L_1_0_0_05-W_0_5-IPC_A]
C107  10u  [FP-0402-L_1_0_0_05-W_0_5-IPC_A]
C108  10n  [FP-0402-L_1_0_0_05-W_0_5-IPC_A]
C109  100n  [FP-0402-L_1_0_0_05-W_0_5-IPC_A]
D16  150066RG54050  [WL-SBCD_0606]
J16  FA1-NDRP-PCB-8  [FA1-NDRP-PCB-8-Footprint-1]
L16  LQW18AN27NJ00D  [FP-LQW18AN_00-MFG]
Q17  DMG1013UW-7  [DIOD-SOT323-3_V]
Q18  BSS138W-7-F  [DIOD-SOT323-3_V]
R115  0402 JUMPER  [RESC1005X40X25ML05T05]  (value not drawn)
R116  100k  [R0603B]
R117  1k  [R0603B]
R118  100k  [R0603B]
R119  10  [R0603B]
R120  560  [R0603B]
R121  100k  [R0603B]
R122  100k  [R0603B]
R123  1k  [R0603B]
R124  100k  [R0603B]
R125  1k  [R0603B]
R138  1k  [R0603B]
R139  1k  [R0603B]
TP4  TPAD6R  [New footprint 1]
U16  MAX-M10M-00B  [MAX-M10M-00B-Footprint-1]
U17  LT6000IDCB#TRMPBF  [FP-DCB-6-05-08-1715-MFG]

### Ports
GPS_nRESET (in, see HU_revB[5D]), GPS_RXD (in, see HU_revB[5D]), GPS_TXD (out, see HU_revB[5D])

### Nets
3V3_AUX: C106.1 C107.1 C109.1 R116.1 R122.1 U16.7(V_IO) U16.8(VCC) U17.6(V+)
GND: C106.2 C107.2 C108.2 C109.2 J16.2(GND) Q18.2(S) R121.2 R124.2 U16.1(GND) U16.10(GND) U16.12(GND) U17.5(V-) U17.7(EP)
ANT_DETECT: R125.2 U16.16(SDA)
ANT_PWR_GATE: Q18.3(D) R117.2
ANT_SENSE: R120.2 R121.1 U17.3(+IN)
ANT_SHORT_N: C108.1 L16.1 R119.2 U16.17(SCL) U17.2(-IN)
GPS_nRESET: R116.2 U16.9(RESET_N) ; port GPS_nRESET
LNA_EN: R123.1 U16.13(LNA_EN)
RF_IN: R115.1 U16.11(RF_IN)
RXD: U16.3(RXD) ; port GPS_RXD
TXD: U16.2(TXD) ; port GPS_TXD
VCC_RF: Q17.2(S) R118.2 U16.14(VCC_RF)
NetD16_1: D16.1(K) R138.2
NetD16_4: D16.4(K) R139.2
NetJ16_1: J16.1(RF) L16.2 R115.2
NetQ17_1: Q17.1(G) R117.1 R118.1
NetQ17_3: Q17.3(D) R119.1 R120.1
NetQ18_1: Q18.1(G) R123.2 R124.1
NetR122_2: R122.2 TP4.1(TP) U16.18(SAFEBOOT_N)
NetR125_1: R125.1 U17.4(OUT)

Not connected (* = marked no-connect by the designer): D16 2(A) 3(A); R138 1; R139 1; U16 4(TIMEPULSE)* 5(EXTINT)* 6(V_BCKP)* 15(VIO_SEL)*; U17 1(~{SHDN})*

### Layout directives
net class 50SINGLE: NetJ16_1, RF_IN

### Notes on the sheet
- LNA + ANT Supervisor Stuff (copied from DS linked at bottom of schematic)
- (near R115) ADDED JUMPER IN CASE WE WANT SERIES CAP HERE
- (near U16) uBlox MAX M10
- https://content.u-blox.com/sites/default/files/documents/MAX-M10M_IntegrationManual_UBX-22038241.pdf#%5B%7B%22num%22%3A936%2C%22gen%22%3A0%7D%2C%7B%22name%22%3A%22XYZ%22%7D%2C59.527%2C624.577%2Cnull%5D

### Library data of the parts
C106-C109 = CMP-001-00058-1: as C19-C28 on sheet NVME; Min Operating Temperature: -55°C; Mounting Technology: Surface Mount; Pins: 2; Case/Package: 0402; RoHS Compliant: Yes; Max Operating Temperature: 85°C
  C106 C109: Value: 100n
  C107: Value: 10u
  C108: Value: 10n
D16 = CMP-004-00040-2: as D15 on sheet GMSL_DESERIALIZER; Source: rgled.SchLib; Component Type: Standard; Design Item ID: CMP-004-00034-2; Pins: 4
J16 = CMP-002-00054-1: RF F Connector, Male, Board Mount, Solder Terminal, Plug; Connector Type: RF F CONNECTOR; RoHS Compliant: Yes; Mounting Technology: Board
L16 = CMP-06042-013840-1: Wire Wound RF Inductor 27nH ±5% 440mA 0.21Ω 0603 (1608); Shielding: Unshielded; Test Frequency: 100MHz; Q Factor: 40; Self Resonant Frequency: 3.7GHz; DC Resistance (DCR): 210mR; Core Material: Non-Magnetic; Depth: 1mm; Min Operating Temperature: -55°C; Package Quantity: 4000; Inductance: 27nH; Case Code (Metric): 1608; Height - Seated (Max): 0.039inch; Resistor Type: Wirewound; Max DC Current: 440mA; Tolerance: 5%; Length: 1.6mm; Mount: Surface Mount; DC Current: 440mA; Packaging: Tape and Reel; Lead Free: Lead Free; Case Code (Imperial): 0603; Current Rating: 440mA; Width: 0.8mm; Max Operating Temperature: 125°C; Termination: SMD/SMT; Weight: 0.000106oz; Radiation Hardening: No; Height: 0.8mm; Case/Package: 0603; Military Standard: Not
Q17 = CMP-2000-06170-1: P-Channel Enhancement Mode MOSFET, 310 mW, 20 V, -55 to 150 degC, 3-Pin SOT-323, RoHS, Tape and Reel; Manufacturer: Diodes Inc; Qg Gate Charge: 0.622nC; Drain-Source On Resistance-Max: 750mO; Rated Power Dissipation: 310mW; Drain-to-Source Voltage [Vdss]: 20V; Package Reference: SOT323; Datasheet Version: Rev. 3-2, 09/2013; Package Description: 3-Pin Small Outline Transistor, Body 2 x 1.25 mm, Pitch 0.65 mm; Mounting Technology: SurfaceMount; Manufacturer URL: http://www.diodes.com/; Datasheet URL: http://www.diodes.com/_files/datasheets/ds31861.pdf; Channel Type: P-Channel
Q18 = CMP-2000-05968-1: as Q16 on sheet PWR_SW; Manufacturer URL: http://www.diodes.com/; Series: BSS138; Package Description: 3-Pin Small Outline Transistor, Body 2 x 1.25 mm, Pitch 0.65 mm; Mounting Technology: SurfaceMount; Product Category: MOSFET; RoHS: True; Maximum Operating Temperature: +150C; Height: 1mm; Length: 2.2mm; Technology: Si; Width: 1.35mm; Datasheet URL: http://www.diodes.com/_files/datasheets/ds30206.pdf; Manufacturer: DiodesIncorporated; Package / Case: SOT-323-3; Typical Turn-On Delay Time: 20ns; Transistor Polarity: N-Channel; Factory Pack Quantity: 3000; Packaging: Reel; Product: MOSFETSmallSignal; Datasheet Version: Rev. 11-2, 09/2013; Package Reference: SOT323; Minimum Operating Temperature: -55C; Mounting Style: SMD/SMT; Channel Mode: Enhancement
R115 = CMP-009-00118-2: READ THE NAME; Pins: 2; Component Type: Standard; Design Item ID: CMP-009-00206-2; Source: 0402jump.SchLib; Value: 0402 JUMPER
R116-R125 R138 R139 = CMP-009-00002-14: Resistor
  R116 R118 R121 R122 R124: Value: 100k
  R117 R123 R125 R138 R139: Value: 1k
  R119: Value: 10
  R120: Value: 560
TP4 = CMP-00025-2: Test Point .6mm
U16 = CMP-010-00031-2: Gnss Lcc Rx Mod, Rom, Crystal
U17 = CMP-09116-000039-1: IC OPAMP GP 1 CIRCUIT 6DFN; Number of Elements: 1; Power Supply Rejection Ratio (PSRR): 86dB; Output Current per Channel: 10mA; Gain Bandwidth Product: 60kHz; Operating Supply Current: 20uA; Input Bias Current: 12nA; Voltage Gain: 120dB; Max Supply Voltage: 18V; Input Offset Voltage (Vos): 1.2mV; Min Supply Voltage: 1.8V; Slew Rate: 0.018V/µs; Common Mode Rejection Ratio: 68dB; Packaging: Tape and Reel; Mount: Surface Mount; Case/Package: DFN; Max Operating Temperature: 85°C; Number of Pins: 6; Number of Amplifiers: 1; REACH SVHC: No SVHC; Unity Gain Bandwidth Product: 60kHz; Bandwidth: 60kHz; Lead Free: Lead Free; Number of Circuits: 1; Min Operating Temperature: -40°C; Package Quantity: 1

## Sheet USB.SchDoc
size A4; SheetNumber: 10; SheetTotal: 17
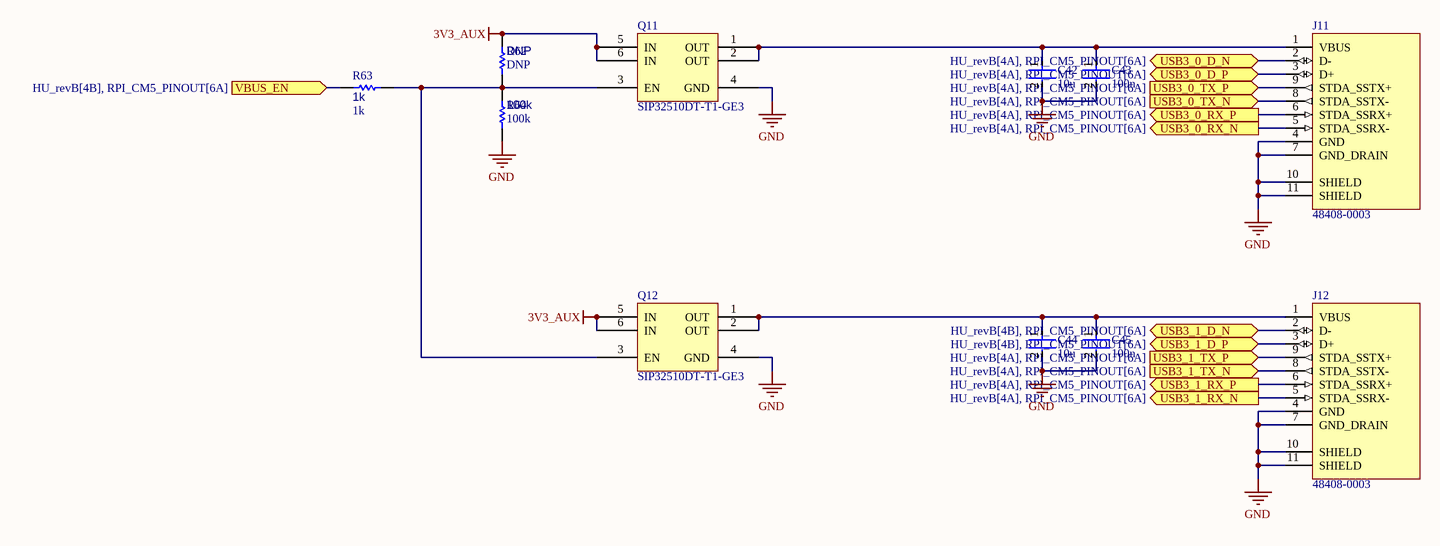
[diagram p24: USB.SchDoc]

### Parts
(Parts that share a designator on the sheet are numbered #1, #2 ... from top to bottom, then left to right.)
C42#2  10u  [FP-0402-L_1_0_0_05-W_0_5-IPC_A]
C43#2  100n  [FP-0402-L_1_0_0_05-W_0_5-IPC_A]
C44  10u  [FP-0402-L_1_0_0_05-W_0_5-IPC_A]
C45  100n  [FP-0402-L_1_0_0_05-W_0_5-IPC_A]
J11  48408-0003  [MOLX-48408-0003_V]
J12  48408-0003  [MOLX-48408-0003_V]
Q11#2  SIP32510DT-T1-GE3  [SOT95P284X110-6N]
Q12  SIP32510DT-T1-GE3  [SOT95P284X110-6N]
R62#2  DNP  [R0603B]
R63#2  1k  [R0603B]
R64#2  100k  [R0603B]

### Ports
USB3_0_D_N (bidir, see HU_revB[4A], RPI_CM5_PINOUT[6A]), USB3_0_D_P (bidir, see HU_revB[4A], RPI_CM5_PINOUT[6A]), USB3_0_RX_N (out, see HU_revB[4A], RPI_CM5_PINOUT[6A]), USB3_0_RX_P (out, see HU_revB[4A], RPI_CM5_PINOUT[6A]), USB3_0_TX_N (in, see HU_revB[4A], RPI_CM5_PINOUT[6A]), USB3_0_TX_P (in, see HU_revB[4A], RPI_CM5_PINOUT[6A]), USB3_1_D_N (bidir, see HU_revB[4B], RPI_CM5_PINOUT[6A]), USB3_1_D_P (bidir, see HU_revB[4B], RPI_CM5_PINOUT[6A]), USB3_1_RX_N (out, see HU_revB[4A], RPI_CM5_PINOUT[6A]), USB3_1_RX_P (out, see HU_revB[4A], RPI_CM5_PINOUT[6A]), USB3_1_TX_N (in, see HU_revB[4A], RPI_CM5_PINOUT[6A]), USB3_1_TX_P (in, see HU_revB[4A], RPI_CM5_PINOUT[6A]), VBUS_EN (in, see HU_revB[4B], RPI_CM5_PINOUT[6A])

### Nets
3V3_AUX: Q11#2.5(IN) Q11#2.6(IN) Q12.5(IN) Q12.6(IN) R62#2.2
GND: C42#2.2 C43#2.2 C44.2 C45.2 J11.4(GND) J11.7(GND_DRAIN) J11.10(SHIELD) J11.11(SHIELD) J12.4(GND) J12.7(GND_DRAIN) J12.10(SHIELD) J12.11(SHIELD) Q11#2.4(GND) Q12.4(GND) R64#2.1
NetC42#2_1: C42#2.1 C43#2.1 J11.1(VBUS) Q11#2.1(OUT) Q11#2.2(OUT)
NetC44_1: C44.1 C45.1 J12.1(VBUS) Q12.1(OUT) Q12.2(OUT)
NetJ11_2: J11.2(D-) ; port USB3_0_D_N
NetJ11_3: J11.3(D+) ; port USB3_0_D_P
NetJ11_5: J11.5(STDA_SSRX-) ; port USB3_0_RX_N
NetJ11_6: J11.6(STDA_SSRX+) ; port USB3_0_RX_P
NetJ11_8: J11.8(STDA_SSTX-) ; port USB3_0_TX_N
NetJ11_9: J11.9(STDA_SSTX+) ; port USB3_0_TX_P
NetJ12_2: J12.2(D-) ; port USB3_1_D_N
NetJ12_3: J12.3(D+) ; port USB3_1_D_P
NetJ12_5: J12.5(STDA_SSRX-) ; port USB3_1_RX_N
NetJ12_6: J12.6(STDA_SSRX+) ; port USB3_1_RX_P
NetJ12_8: J12.8(STDA_SSTX-) ; port USB3_1_TX_N
NetJ12_9: J12.9(STDA_SSTX+) ; port USB3_1_TX_P
NetQ11#2_3: Q11#2.3(EN) Q12.3(EN) R62#2.1 R63#2.1 R64#2.2
NetR63#2_2: R63#2.2 ; port VBUS_EN

### Library data of the parts
C42#2 C43#2 C44 C45 = CMP-001-00058-1: as C19-C28 on sheet NVME; Min Operating Temperature: -55°C; Mounting Technology: Surface Mount; Pins: 2; Case/Package: 0402; RoHS Compliant: Yes; Max Operating Temperature: 85°C
J11 J12 = CMP-0411-00003-1: Universal Serial Bus (USB 3.0) I/O Connector, Vertical, Type A, Through Hole, 9 Circuits, -20 to 85 degC, RoHS, Tray; No. of Positions: 9; No. of Rows: 2; Packing: Tray; Orientation: Vertical; ComponentLink3Description: Package Specification; ComponentLink2URL: http://www.molex.com/webdocs/datasheets/pdf/en-us/0484080003_IO_CONNECTORS.pdf; ComponentLink3URL: http://www.molex.com/pdm_docs/sd/484080003_sd.pdf; ComponentLink1Description: Manufacturer URL; PackageVersion: Rev. F, 12/2012; Mounting Technology: Through Hole; Temperature Min: -20 degC; ComponentLink2Description: Datasheet; PackageDescription: 9-Pin USB 3.0 I/O Receptacle, Vertical, Height 15.25 mm, Through Hole; PartNumber: 48408-0003; Temperature Max: 85 degC; RoHS: TRUE; ComponentLink1URL: http://www.molex.com/
Q11#2 Q12 = CMP-019-00054-1: Power Switch ICs – Power Distribution; VISHAY; SIP32510DT-T1-GE3; 1; 1; 5.5 V; SOT-23-6; Max Supply Voltage: 5.5V; Max Power Dissipation: 833mW; Min Supply Voltage: 1.2V; Case/Package: SOT-23-6; Mounting Technology: Surface Mount; Max Operating Temperature: 85°C; Min Operating Temperature: -40°C
R62#2 R63#2 R64#2 = CMP-009-00002-14: Resistor
  R62#2: Value: DNP
  R63#2: Value: 1k
  R64#2: Value: 100k

## Sheet TS3USB221A_PINOUT.SchDoc
size A4; SheetNumber: 16; SheetTotal: 17
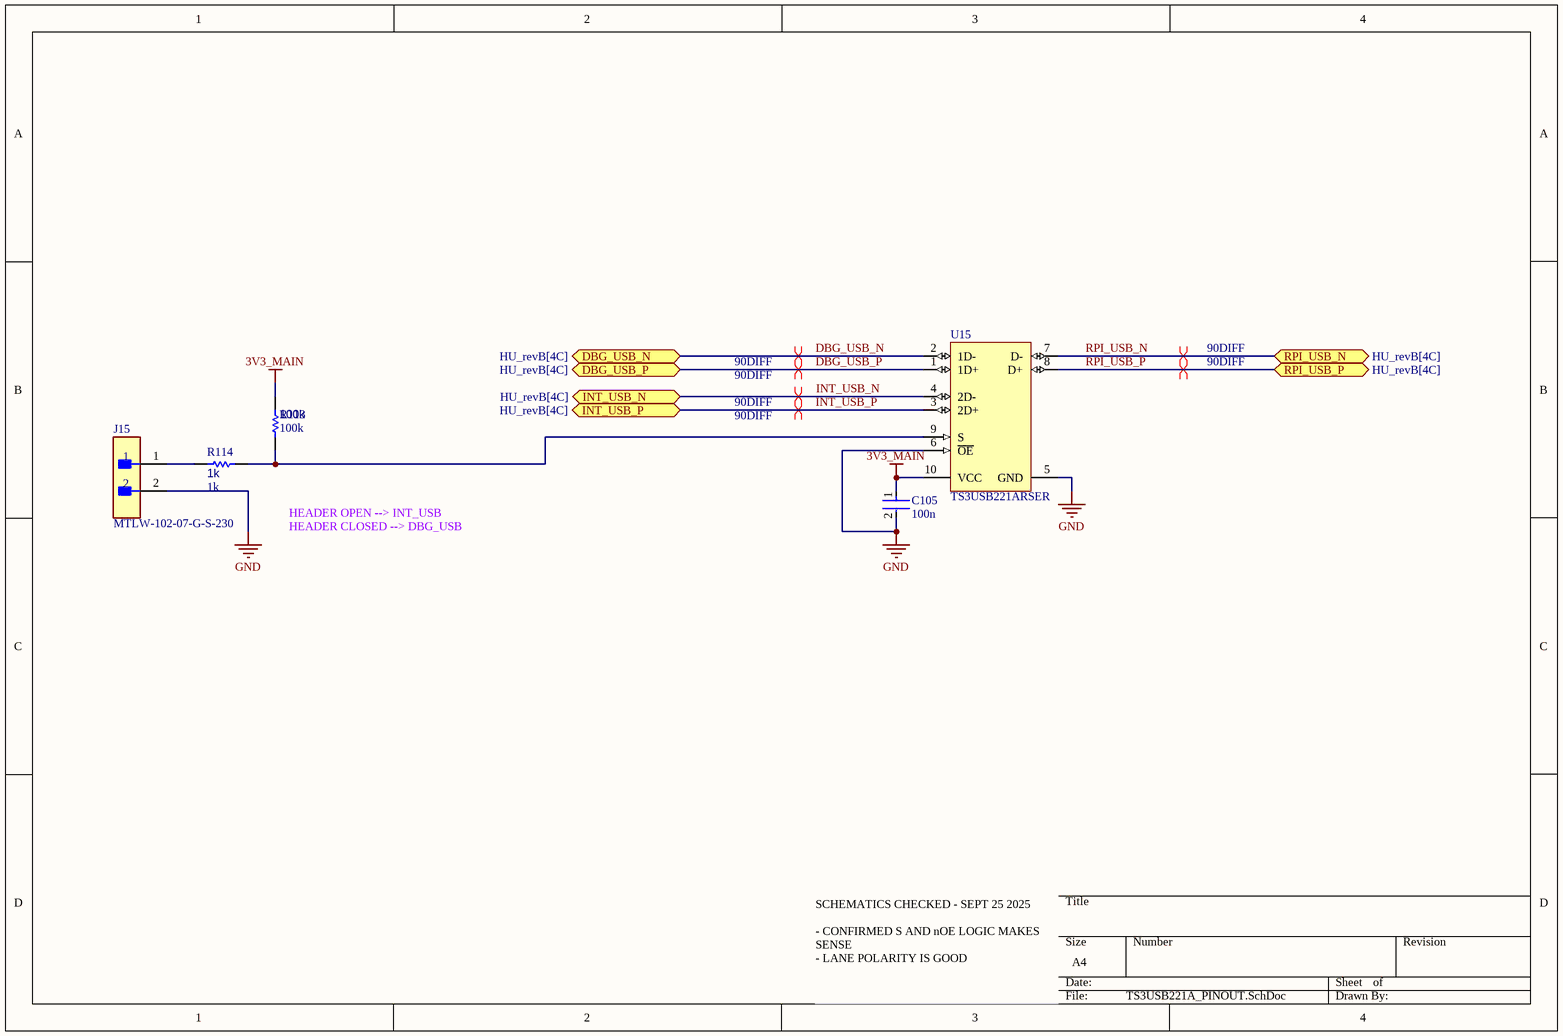
[diagram p25: TS3USB221A_PINOUT.SchDoc]

### Parts
C105  100n  [FP-0402-L_1_0_0_05-W_0_5-IPC_A]
J15  MTLW-102-07-G-S-230  [FP-MTLW-102-07-G-S-230-MFG]
R113  100k  [R0603B]
R114  1k  [R0603B]
U15  TS3USB221ARSER  [RSE0010A_V]

### Ports
DBG_USB_N (bidir, see HU_revB[4C]), DBG_USB_P (bidir, see HU_revB[4C]), INT_USB_N (bidir, see HU_revB[4C]), INT_USB_P (bidir, see HU_revB[4C]), RPI_USB_N (bidir, see HU_revB[4C]), RPI_USB_P (bidir, see HU_revB[4C])

### Nets
3V3_MAIN: C105.1 R113.2 U15.10(VCC)
GND: C105.2 J15.2 U15.5(GND) U15.6(~{OE})
DBG_USB_N: U15.2(1D-) ; port DBG_USB_N
DBG_USB_P: U15.1(1D+) ; port DBG_USB_P
INT_USB_N: U15.4(2D-) ; port INT_USB_N
INT_USB_P: U15.3(2D+) ; port INT_USB_P
RPI_USB_N: U15.7(D-) ; port RPI_USB_N
RPI_USB_P: U15.8(D+) ; port RPI_USB_P
NetJ15_1: J15.1 R114.2
NetR113_1: R113.1 R114.1 U15.9(S)

### Layout directives
differential pair; differential pair class 90DIFF: DBG_USB_N, DBG_USB_P, INT_USB_N, INT_USB_P, RPI_USB_N, RPI_USB_P

### Notes on the sheet
- HEADER OPEN --> INT_USB
  HEADER CLOSED --> DBG_USB
- SCHEMATICS CHECKED - SEPT 25 2025
  - CONFIRMED S AND nOE LOGIC MAKES SENSE
  - LANE POLARITY IS GOOD

### Library data of the parts
C105 = CMP-001-00058-1: as C19-C28 on sheet NVME; Min Operating Temperature: -55°C; Mounting Technology: Surface Mount; Pins: 2; Case/Package: 0402; RoHS Compliant: Yes; Max Operating Temperature: 85°C
J15 = CMP-02766-001053-1: CONN HEADER VERT 2POS 2.54MM; Max Current Rating: 3A; Number of Contacts: 2; Gender: Male; Housing Color: Black; Housing Material: Polymer; Radiation Hardening: No; Min Operating Temperature: -55°C; Contact Plating: Gold; Termination: Solder; Number of Rows: 1; Max Operating Temperature: 125°C; Contact Material: Bronze; Pitch: 2.54mm; Depth: 2.48mm; Length: 5.08mm; Orientation: Straight; Packaging: Bulk
R113 R114 = CMP-009-00002-14: Resistor
  R113: Value: 100k
  R114: Value: 1k
U15 = CMP-0309-00017-2: ESD Protected,High-Speed USB 2.0 (480-Mbps) 1:2 Multiplexer / Demultiplexer Switch, 1:2 Mux / Demux, 6 ohm RON, 2.5 to 3.3V, -40 to 85 degC, 10-Pin UQFN (RSE), Green (RoHS & no Sb/Br); Manufacturer: Texas Instruments; tpd max(ns): 0.25; RON Mis-match(Max)(Ohms): 0.2; OFF Time(Max)(ns): 12; Architecture: "1","2 mux/demux"; IL OFF(Max)(nA): 2; SubFamily: USB Switch; ESD HBM(kV): +/-7; ron(max)(ohms): 6; ON Time(Max)(ns): 30; Bandwidth(MHz): 900; RON Flatness(Max)(Ohms): 1; Vcc range(V): 2.3 to 3.6; Mounting Technology: Surface Mount; ComponentLink2URL: http://www.ti.com/lit/ml/mpqf186c/mpqf186c.pdf; PackageDescription: 10-Leads Plastic Quad Flatpack No-Lead, 2 x 1.5 x 0.55 mm Body, 0.5 mm Pitch; ComponentLink1URL: http://www.ti.com/general/docs/lit/getliterature.tsp?genericPartNumber=TS3USB221A&fileType=pdf; PackageReference: RSE0010A; ComponentLink2Description: Package Specification; PartNumber: TS3USB221ARSER; Code_JEDEC: MO-288-UEFD; DatasheetVersion: SCDS277; ComponentLink1Description: Datasheet; Eco-Plan: Green (RoHS & no Sb/Br); Number of Channels: 2; PackageVersion: revD, Jan-2011; ICC(uA): 30